# Altium project Main.PrjPCB (part 1 of 2)
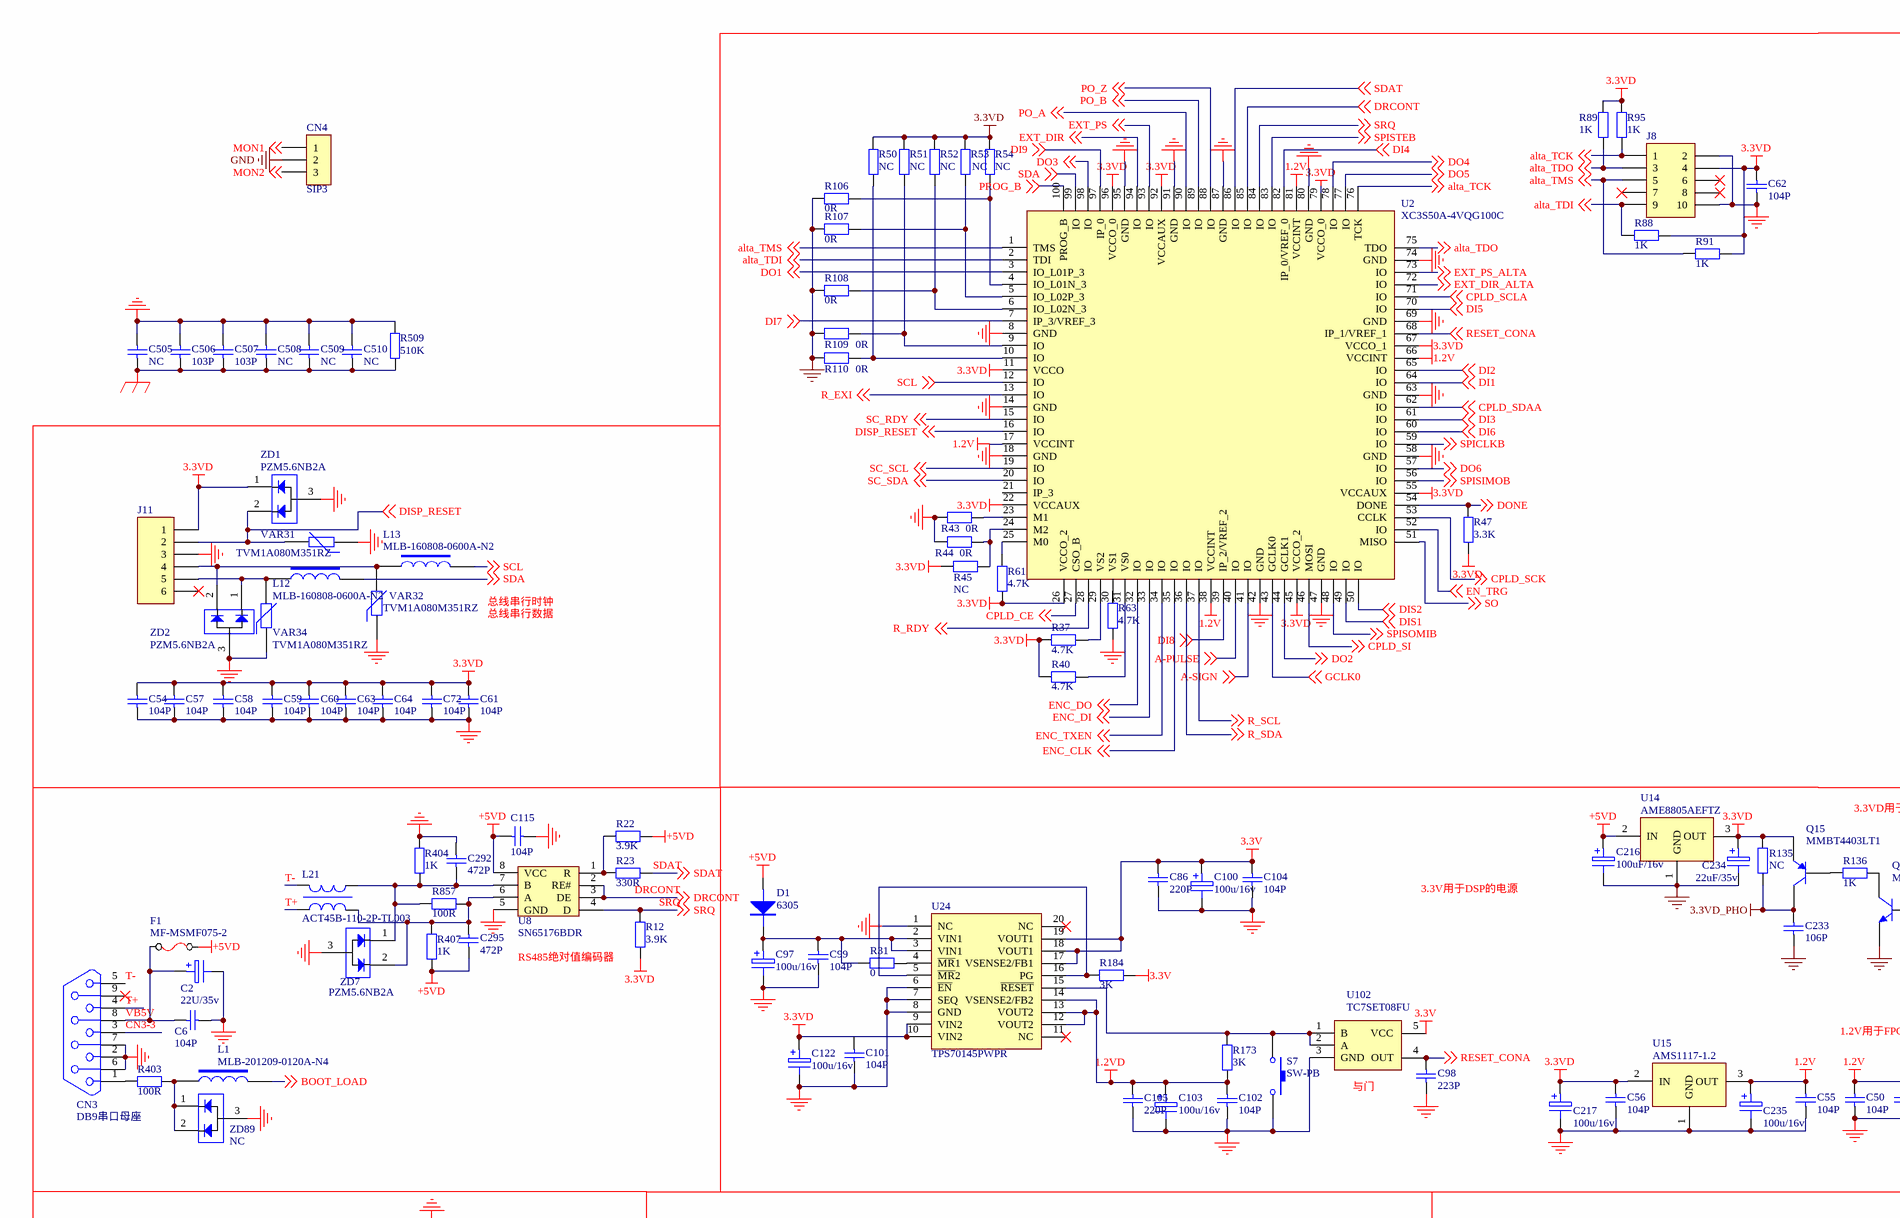
[diagram p0: Main-C.SchDoc, top left]
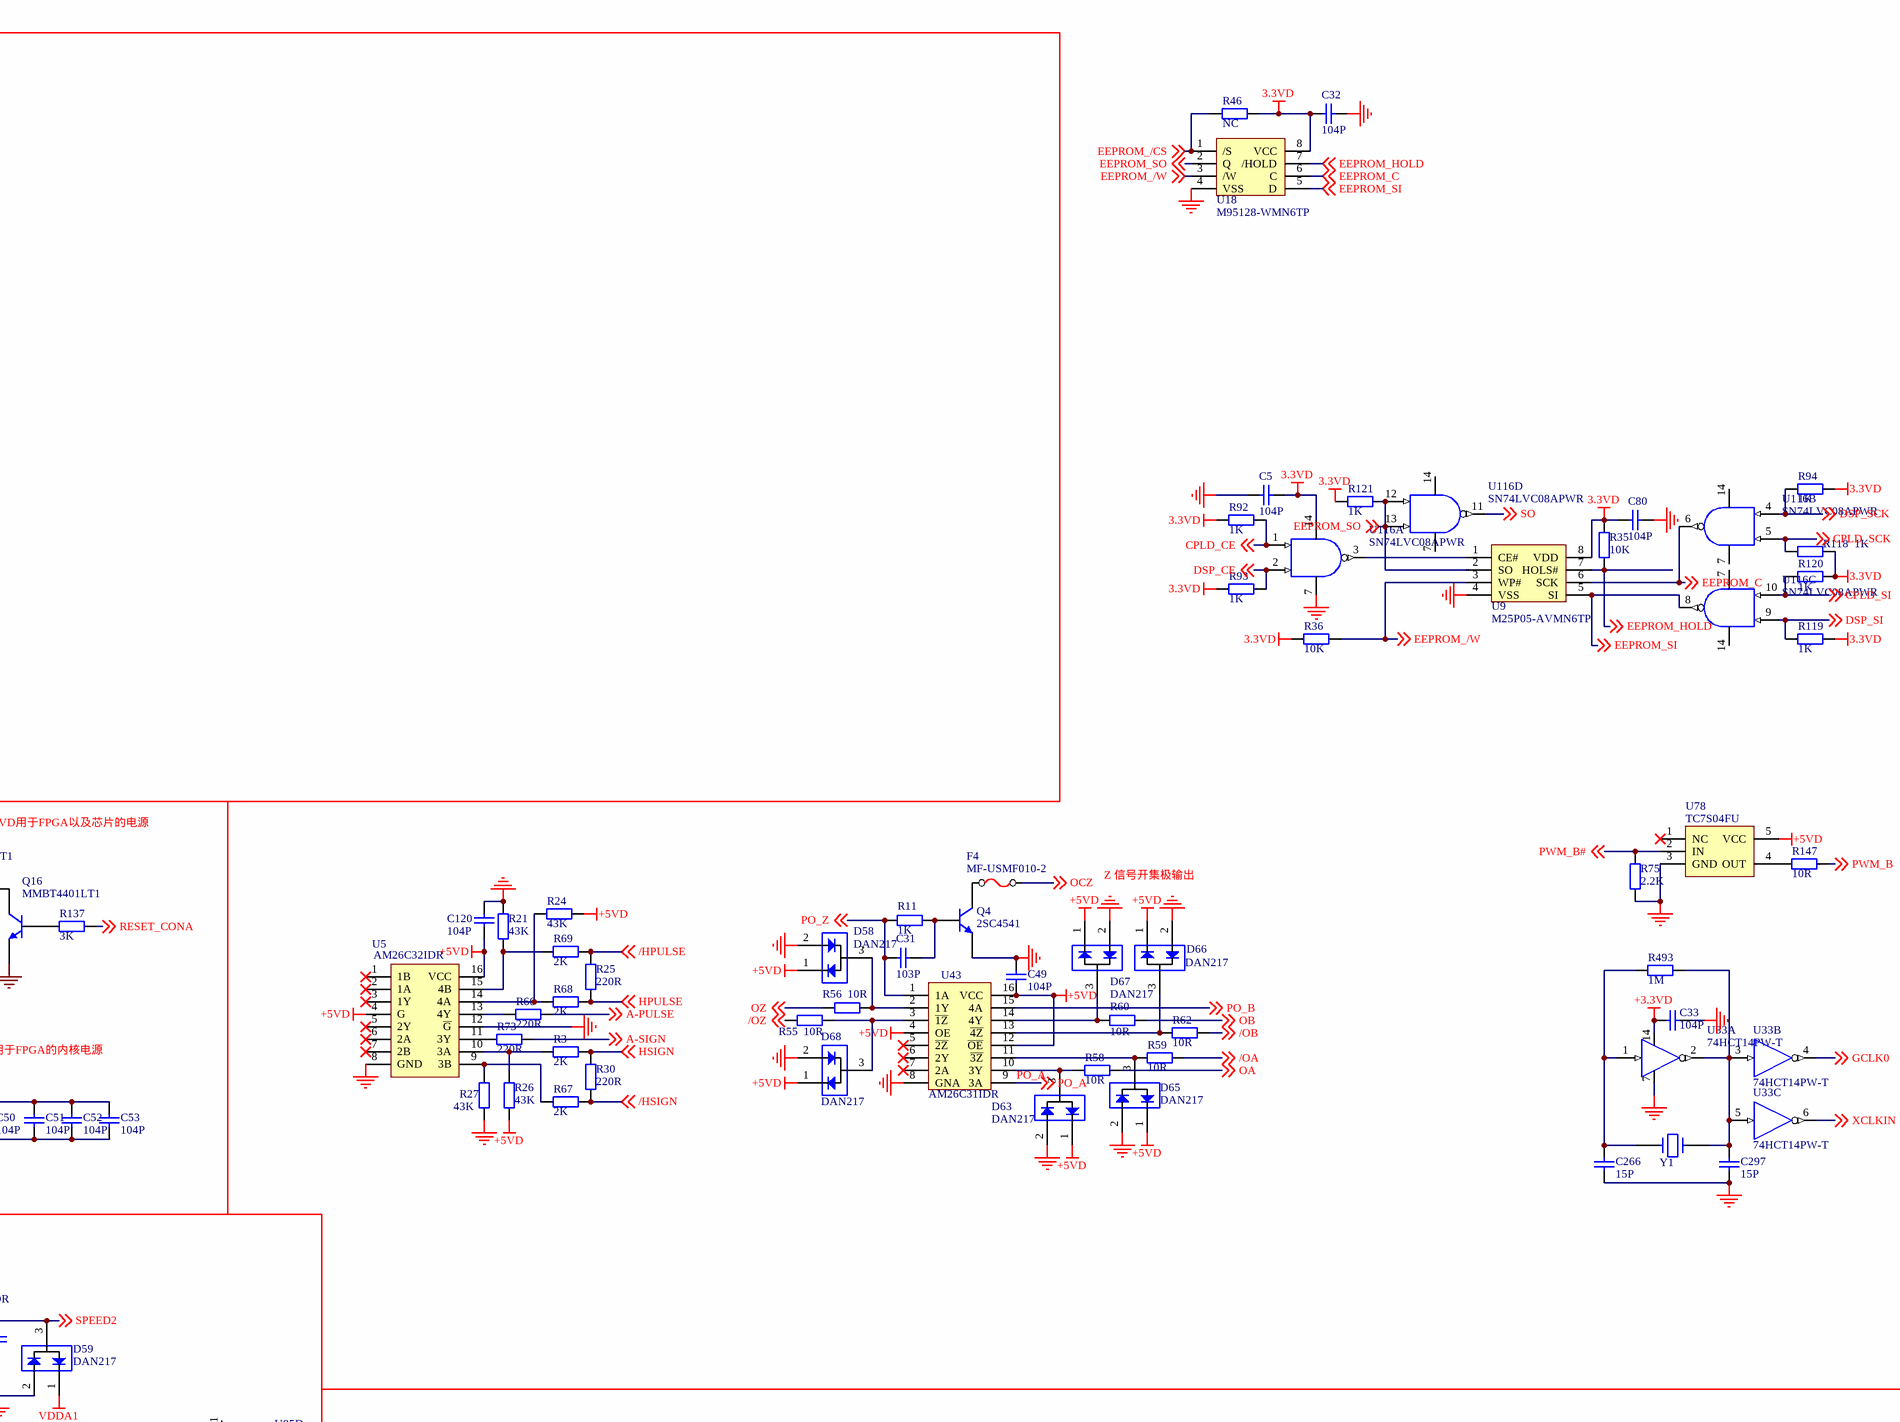
[diagram p1: Main-C.SchDoc, top middle]
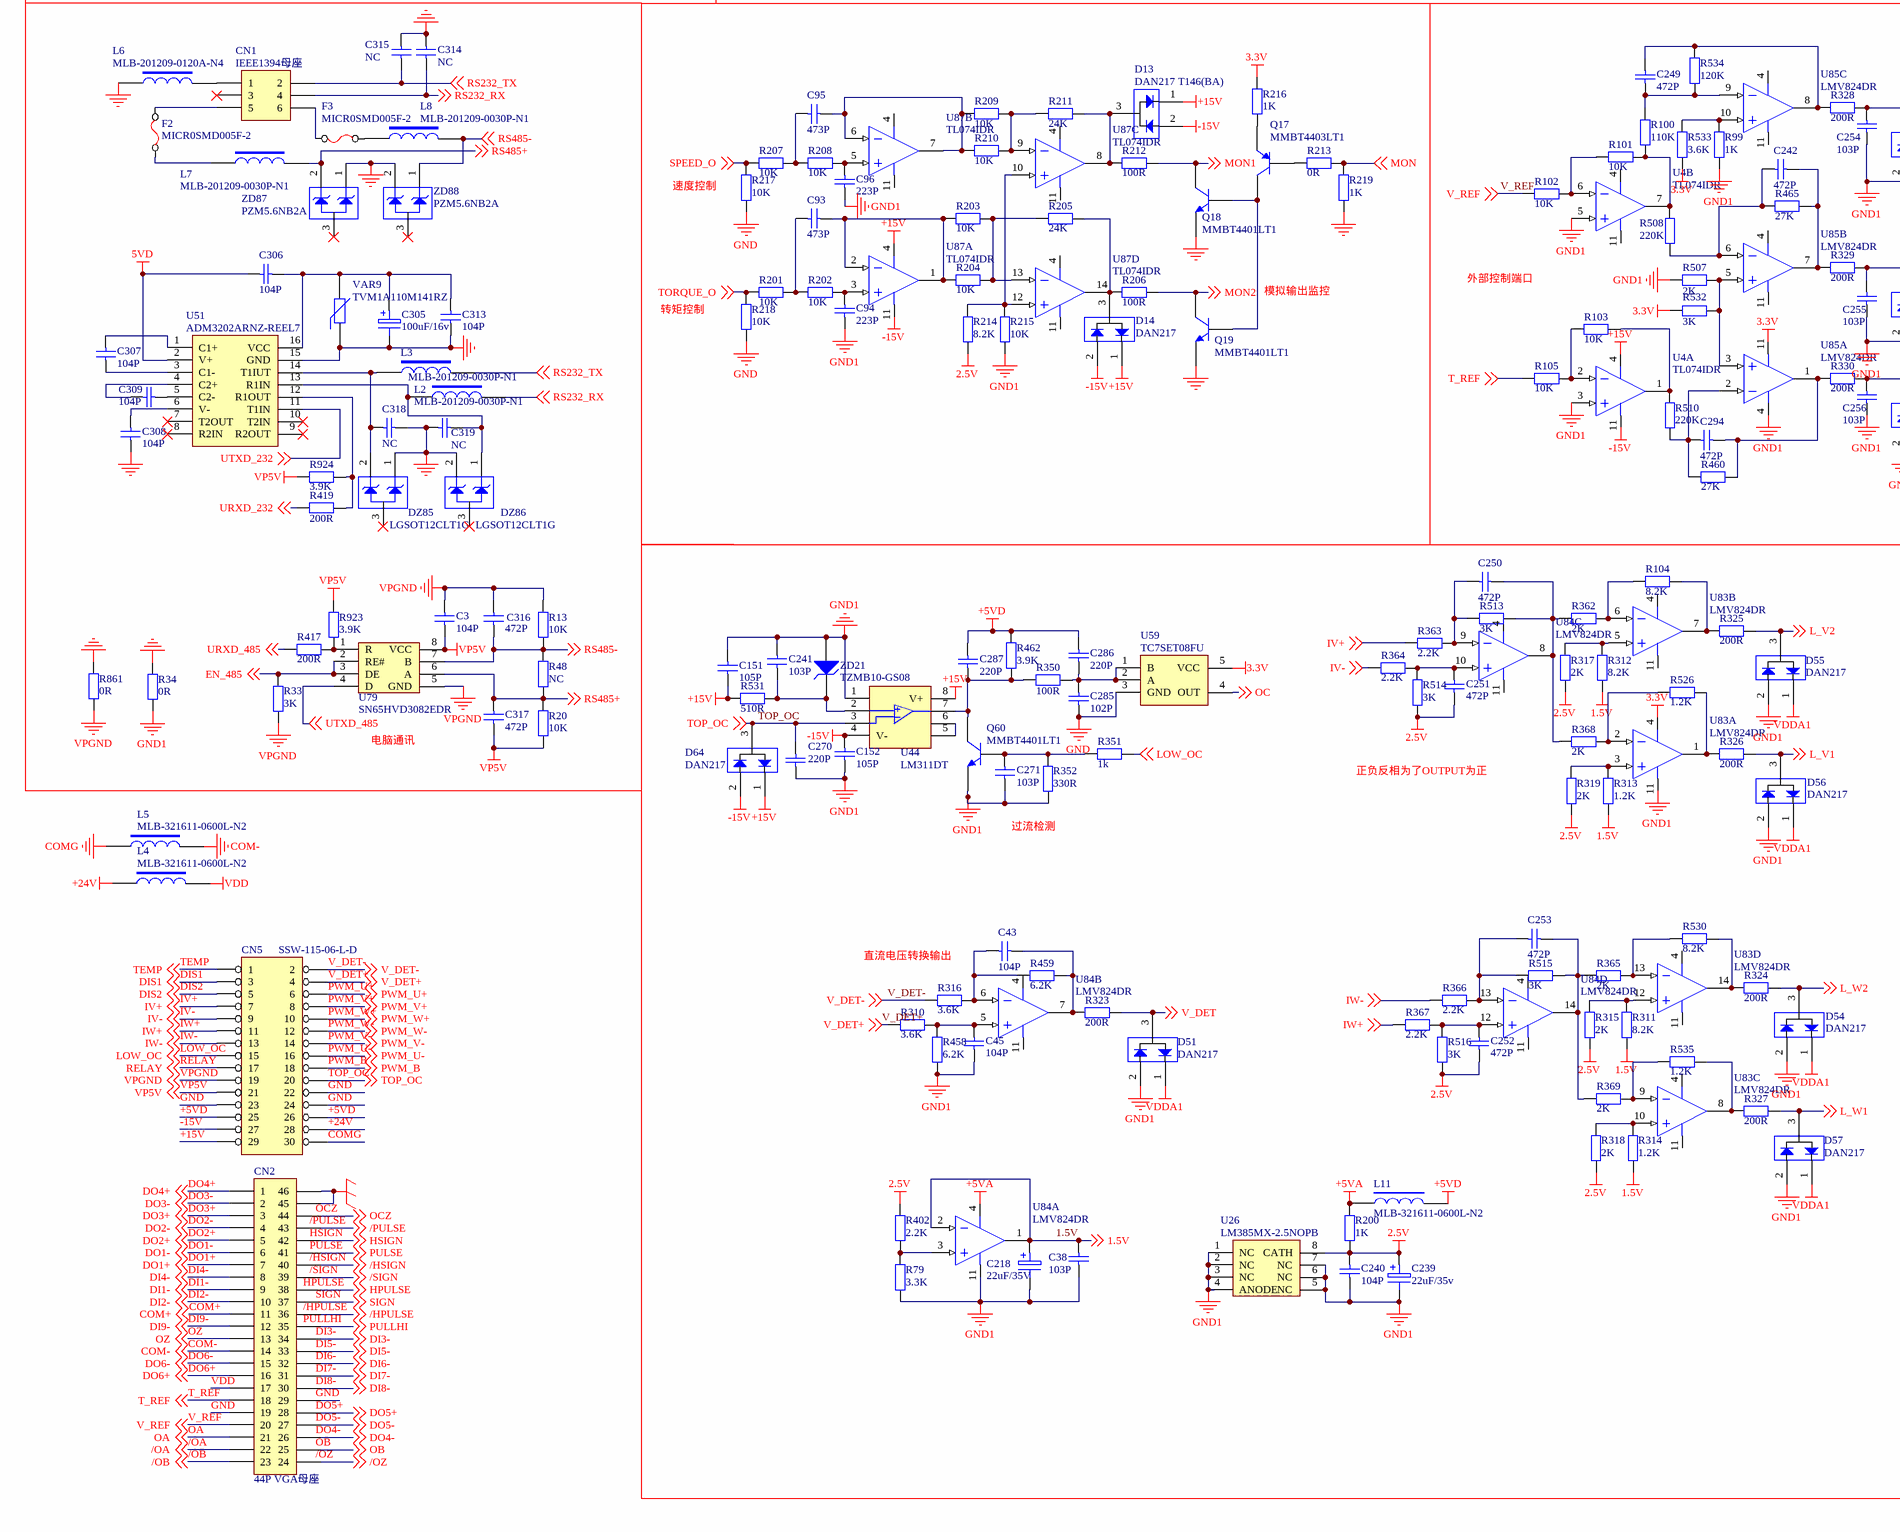
[diagram p2: Main-C.SchDoc, bottom left]
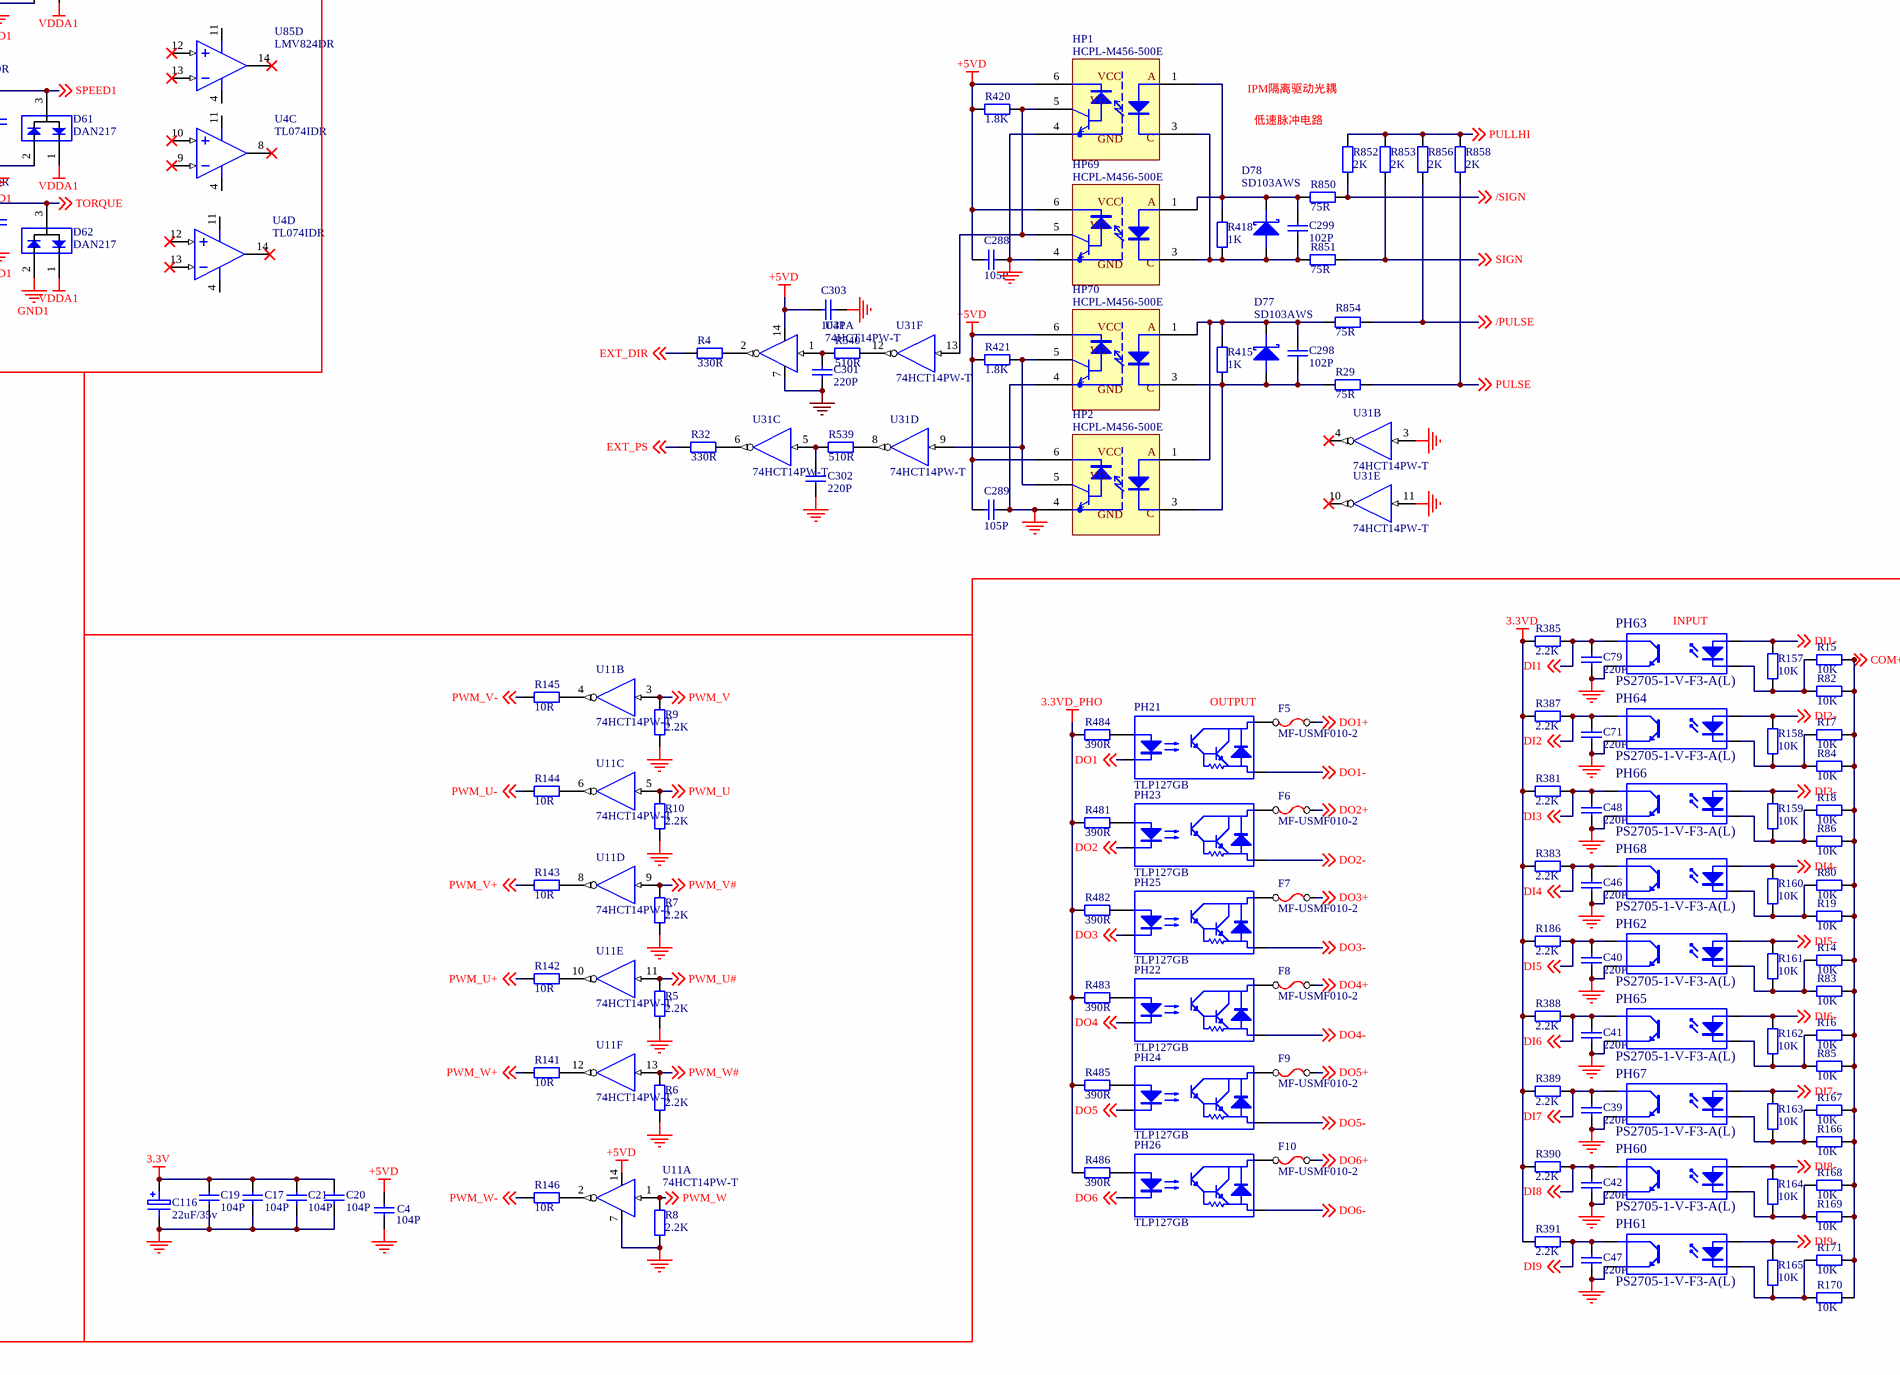
[diagram p3: Main-C.SchDoc, bottom middle]
6 sheets, 660 parts. Net scope: global (net labels, ports and power ports of the same name join across sheets).
Sheets:
  Main-C.SchDoc
  DSP-Core.SchDoc
  EnDat-Biss.SchDoc
  SinCos.SchDoc
  Resolver.SchDoc
  EtherCAT.SchDoc

## Sheet Main-C.SchDoc
size A1; PageSetup: Record=PageOptions|CenterHorizontal=True|CenterVertical=True|PrintScale=0.50|XCorrection=1.00|YCorrection=1.00|PrintKind=2|BorderSize=5000000|LeftOffset=0|BottomOffset=0|Orientation=2|PaperLength=4200|PaperWidth=2970|Scale=100|PaperSource=7|PrintQuality=600|MediaType=1|DitherType=10|PrintScaleMode=1|PaperKind=A3|PaperIndex=8

### Parts
C2  22U/35v  [EC46]
C3  104P  [0603C]
C4  104P  [0603C]
C5  104P  [0603C]
C6  104P  [0603C]
C17  104P  [0603C]
C19  104P  [0603C]
C20  104P  [0603C]
C21  104P  [0603C]
C31  103P  [0603C]
C32  104P  [0603C]
C33  104P  [0603C]
C38  103P  [0603C]
C39  220P  [0603C]
C40  220P  [0603C]
C41  220P  [0603C]
C42  220P  [0603C]
C43  104P  [0603C]
C45  104P  [0603C]
C46  220P  [0603C]
C47  220P  [0603C]
C48  220P  [0603C]
C49  104P  [0603C]
C50  104P  [0603C]
C51  104P  [0603C]
C52  104P  [0603C]
C53  104P  [0603C]
C54  104P  [0603C]
C55  104P  [0603C]
C56  104P  [0603C]
C57  104P  [0603C]
C58  104P  [0603C]
C59  104P  [0603C]
C60  104P  [0603C]
C61  104P  [0603C]
C62  104P  [0603C]
C63  104P  [0603C]
C64  104P  [0603C]
C71  220P  [0603C]
C72  104P  [0603C]
C79  220P  [0603C]
C80  104P  [0603C]
C86  220P  [0603C]
C93  473P  [0603C]
C94  223P  [0603C]
C95  473P  [0603C]
C96  223P  [0603C]
C97  100u/16v  [EC46]
C98  223P  [0603C]
C99  104P  [0603C]
C100  100u/16v  [EC46]
C101  104P  [0603C]
C102  104P  [0603C]
C103  100u/16v  [EC46]
C104  104P  [0603C]
C105  220P  [0603C]
C115  104P  [0603C]
C116  22uF/35v  [EC46]
C120  104P  [0603C]
C122  100u/16v  [EC46]
C151  105P  [0805C]
C152  105P  [0805C]
C216  100uF/16v  [EC46]
C217  100u/16v  [EC46]
C218  22uF/35V  [EC46]
C233  106P  [0805C]
C234  22uF/35v  [EC46]
C235  100u/16v  [EC46]
C239  22uF/35v  [EC46]
C240  104P  [0603C]
C241  103P  [0603C]
C242  472P  [0603C]
C249  472P  [0603C]
C250  472P  [0603C]
C251  472P  [0603C]
C252  472P  [0603C]
C253  472P  [0603C]
C254  103P  [0603C]
C255  103P  [0603C]
C256  103P  [0603C]
C266  15P  [0603C]
C270  220P  [0603C]
C271  103P  [0603C]
C285  102P  [0603C]
C286  220P  [0603C]
C287  220P  [0603C]
C288  105P  [0805C]
C289  105P  [0805C]
C292  472P  [0603C]
C294  472P  [0603C]
C295  472P  [0603C]
C297  15P  [0603C]
C298  102P  [0603C]
C299  102P  [0603C]
C301  220P  [0603C]
C302  220P  [0603C]
C303  104P  [0603C]
C305  100uF/16v  [EC46]
C306  104P  [0603C]
C307  104P  [0603C]
C308  104P  [0603C]
C309  104P  [0603C]
C313  104P  [0603C]
C314  NC  [0603C]
C315  NC  [0603C]
C316  472P  [0603C]
C317  472P  [0603C]
C318  NC  [0603C]
C319  NC  [0603C]
C505  NC  [2220]
C506  103P  [2220]
C507  103P  [2220]
C508  NC  [2220]
C509  NC  [2220]
C510  NC  [2220]
CN1  IEEE1394母座  [HDR2X3H]
CN2  44P VGA母座
CN3  value DB9串口母座  [DB9/F]  (hidden comment: Z2-DB9P/M)
CN4  SIP3  [SIP3-2.54]
CN5  SSW-115-06-L-D  [TB18]
D1  6305  [MLL35D]
D13  DAN217 T146(BA)  [SOT-23]
D14  DAN217  [SOT-23]
D51  DAN217  [SOT-23]
D54  DAN217  [SOT-23]
D55  DAN217  [SOT-23]
D56  DAN217  [SOT-23]
D57  DAN217  [SOT-23]
D58  DAN217  [SOT-23]
D59  DAN217  [SOT-23]
D61  DAN217  [SOT-23]
D62  DAN217  [SOT-23]
D63  DAN217  [SOT-23]
D64  DAN217  [SOT-23]
D65  DAN217  [SOT-23]
D66  DAN217  [SOT-23]
D67  DAN217  [SOT-23]
D68  DAN217  [SOT-23]
D77  SD103AWS
D78  SD103AWS
DZ85  LGSOT12CLT1G  [SOT-23]
DZ86  LGSOT12CLT1G  [SOT-23]
F1  MF-MSMF075-2
F2  MICR0SMD005F-2
F3  MICR0SMD005F-2
F4  MF-USMF010-2
F5  MF-USMF010-2
F6  MF-USMF010-2
F7  MF-USMF010-2
F8  MF-USMF010-2
F9  MF-USMF010-2
F10  MF-USMF010-2
HP1  HCPL-M456-500E  [SOP-5]
HP2  HCPL-M456-500E  [SOP-5]
HP69  HCPL-M456-500E  [SOP-5]
HP70  HCPL-M456-500E  [SOP-5]
J8  (no value)  [HDR2X5]
J11  Header 6  [HDR1X6]  (value not drawn)
L1  MLB-201209-0120A-N4  [1206R]
L2  MLB-201209-0030P-N1  [0805R]
L3  MLB-201209-0030P-N1  [0805R]
L4  MLB-321611-0600L-N2  [1206R]
L5  MLB-321611-0600L-N2  [1206R]
L6  MLB-201209-0120A-N4  [0805R]
L7  MLB-201209-0030P-N1  [0805R]
L8  MLB-201209-0030P-N1  [0805R]
L11  MLB-321611-0600L-N2  [1206R]
L12  MLB-160808-0600A-N2  [0805R]
L13  MLB-160808-0600A-N2  [0805R]
L21  ACT45B-110-2P-TL003  [INDUCTOR-M]
PH21  TLP127GB
PH22  TLP127GB
PH23  TLP127GB
PH24  TLP127GB
PH25  TLP127GB
PH26  TLP127GB
PH60  PS2705-1-V-F3-A(L)  [SOIC4]
PH61  PS2705-1-V-F3-A(L)  [SOIC4]
PH62  PS2705-1-V-F3-A(L)  [SOIC4]
PH63  PS2705-1-V-F3-A(L)  [SOIC4]
PH64  PS2705-1-V-F3-A(L)  [SOIC4]
PH65  PS2705-1-V-F3-A(L)  [SOIC4]
PH66  PS2705-1-V-F3-A(L)  [SOIC4]
PH67  PS2705-1-V-F3-A(L)  [SOIC4]
PH68  PS2705-1-V-F3-A(L)  [SOIC4]
Q4  2SC4541  [sot-89]
Q15  MMBT4403LT1  [SOT-23]
Q16  MMBT4401LT1  [SOT-23]
Q17  MMBT4403LT1  [SOT-23]
Q18  MMBT4401LT1  [SOT-23]
Q19  MMBT4401LT1  [SOT-23]
Q60  MMBT4401LT1  [SOT-23]
R3  2K  [0603R]
R4  330R  [0603R]
R5  2.2K  [0603R]
R6  2.2K  [0603R]
R7  2.2K  [0603R]
R8  2.2K  [0603R]
R9  2.2K  [0603R]
R10  2.2K  [0603R]
R11  1K  [0603R]
R12  3.9K  [0603R]
R13  10K  [0603R]
R14  10K  [1206R]
R15  10K  [1206R]
R16  10K  [1206R]
R17  10K  [1206R]
R18  10K  [1206R]
R19  10K  [1206R]
R20  10K  [0603R]
R21  43K  [0603R]
R22  3.9K  [0603R]
R23  330R  [0603R]
R24  43K  [0603R]
R25  220R  [1206R]
R26  43K  [0603R]
R27  43K  [0603R]
R29  75R  [0603R]
R30  220R  [1206R]
R31  0  [0603R]
R32  330R  [0603R]
R33  3K  [0603R]
R34  0R  [0603R]
R35  10K  [0603R]
R36  10K  [0603R]
R37  4.7K  [0603R]
R40  4.7K  [0603R]
R43  0R  [0603R]
R44  0R  [0603R]
R45  NC  [0603R]
R46  NC  [0603R]
R47  3.3K  [0603R]
R48  NC  [1206R]
R50  NC  [0603R]
R51  NC  [0603R]
R52  NC  [0603R]
R53  NC  [0603R]
R54  NC  [0603R]
R55  10R  [0603R]
R56  10R  [0603R]
R58  10R  [0603R]
R59  10R  [0603R]
R60  10R  [0603R]
R61  4.7K  [0603R]
R62  10R  [0603R]
R63  4.7K  [0603R]
R66  220R  [0603R]
R67  2K  [0603R]
R68  2K  [0603R]
R69  2K  [0603R]
R73  220R  [0603R]
R75  2.2K  [0603R]
R79  3.3K  [0603R]
R80  10K  [1206R]
R82  10K  [1206R]
R83  10K  [1206R]
R84  10K  [1206R]
R85  10K  [1206R]
R86  10K  [1206R]
R88  1K  [0603R]
R89  1K  [0603R]
R91  1K  [0603R]
R92  1K  [0603R]
R93  1K  [0603R]
R94  1K  [0603R]
R95  1K  [0603R]
R99  1K  [0603R]
R100  110K  [0603R]
R101  10K  [0603R]
R102  10K  [0603R]
R103  10K  [0603R]
R104  8.2K  [0603R]
R105  10K  [0603R]
R106  0R  [0603R]
R107  0R  [0603R]
R108  0R  [0603R]
R109  0R  [0603R]
R110  0R  [0603R]
R118  1K  [0603R]
R119  1K  [0603R]
R120  1K  [0603R]
R121  1K  [0603R]
R135  NC  [0603R]
R136  1K  [0603R]
R137  3K  [0603R]
R141  10R  [0603R]
R142  10R  [0603R]
R143  10R  [0603R]
R144  10R  [0603R]
R145  10R  [0603R]
R146  10R  [0603R]
R147  10R  [0603R]
R157  10K  [1206R]
R158  10K  [1206R]
R159  10K  [1206R]
R160  10K  [1206R]
R161  10K  [1206R]
R162  10K  [1206R]
R163  10K  [1206R]
R164  10K  [1206R]
R165  10K  [1206R]
R166  10K  [1206R]
R167  10K  [1206R]
R168  10K  [1206R]
R169  10K  [1206R]
R170  10K  [1206R]
R171  10K  [1206R]
R173  3K  [0603R]
R184  3K  [0603R]
R186  2.2K  [0603R]
R200  1K  [0603R]
R201  10K  [0603R]
R202  10K  [0603R]
R203  10K  [0603R]
R204  10K  [0603R]
R205  24K  [0603R]
R206  100R  [1206R]
R207  10K  [0603R]
R208  10K  [0603R]
R209  10K  [0603R]
R210  10K  [0603R]
R211  24K  [0603R]
R212  100R  [1206R]
R213  0R  [0603R]
R214  8.2K  [0603R]
R215  10K  [0603R]
R216  1K  [0603R]
R217  10K  [0603R]
R218  10K  [0603R]
R219  1K  [0603R]
R310  3.6K  [0603R]
R311  8.2K  [0603R]
R312  8.2K  [0603R]
R313  1.2K  [0603R]
R314  1.2K  [0603R]
R315  2K  [0603R]
R316  3.6K  [0603R]
R317  2K  [0603R]
R318  2K  [0603R]
R319  2K  [0603R]
R323  200R  [0603R]
R324  200R  [0603R]
R325  200R  [0603R]
R326  200R  [0603R]
R327  200R  [0603R]
R328  200R  [0603R]
R329  200R  [0603R]
R330  200R  [0603R]
R350  100R  [0603R]
R351  1k  [0603R]
R352  330R  [0603R]
R362  2K  [0603R]
R363  2.2K  [0603R]
R364  2.2K  [0603R]
R365  2K  [0603R]
R366  2.2K  [0603R]
R367  2.2K  [0603R]
R368  2K  [0603R]
R369  2K  [0603R]
R381  2.2K  [0603R]
R383  2.2K  [0603R]
R385  2.2K  [0603R]
R387  2.2K  [0603R]
R388  2.2K  [0603R]
R389  2.2K  [0603R]
R390  2.2K  [0603R]
R391  2.2K  [0603R]
R402  2.2K  [0603R]
R403  100R  [0603R]
R404  1K  [0603R]
R407  1K  [0603R]
R415  1K  [0603R]
R417  200R  [0603R]
R418  1K  [0603R]
R419  200R  [0603R]
R420  1.8K  [0603R]
R421  1.8K  [0603R]
R458  6.2K  [0603R]
R459  6.2K  [0603R]
R460  27K  [0603R]
R462  3.9K  [0603R]
R465  27K  [0603R]
R481  390R  [0603R]
R482  390R  [0603R]
R483  390R  [0603R]
R484  390R  [0603R]
R485  390R  [0603R]
R486  390R  [0603R]
R493  1M  [0603R]
R507  2K  [0603R]
R508  220K  [0603R]
R509  510K  [2512]
R510  220K  [0603R]
R513  3K  [0603R]
R514  3K  [0603R]
R515  3K  [0603R]
R516  3K  [0603R]
R526  1.2K  [0603R]
R530  8.2K  [0603R]
R531  510R  [0603R]
R532  3K  [0603R]
R533  3.6K  [0603R]
R534  120K  [0603R]
R535  1.2K  [0603R]
R539  510R  [0603R]
R540  510R  [0603R]
R850  75R  [0603R]
R851  75R  [0603R]
R852  2K  [0603R]
R853  2K  [0603R]
R854  75R  [0603R]
R856  2K  [0603R]
R857  100R  [0603R]
R858  2K  [0603R]
R861  0R  [0603R]
R923  3.9K  [0603R]
R924  3.9K  [0603R]
S7  SW-PB  [SPST-2]
U2  XC3S50A-4VQG100C  [VFQ100]
U4  TL074IDR  [SOP-14]  (parts A,B,C,D of 4)
U5  AM26C32IDR  [SO-16]
U8  SN65176BDR  [SOP-8]
U9  M25P05-AVMN6TP  [SOP-8]
U11  74HCT14PW-T  [sop-14]  (parts A,B,C,D,E,F of 6)
U14  AME8805AEFTZ  [SOT-89]
U15  AMS1117-1.2  [SOT-223]
U18  M95128-WMN6TP  [SOP-8]
U24  TPS70145PWPR  [SSOP-20-1]
U26  LM385MX-2.5NOPB  [SOP-8]
U31  74HCT14PW-T  [sop-14]  (parts A,B,C,D,E,F of 6)
U33  74HCT14PW-T  [sop-14]  (parts A,B,C of 6)
U43  AM26C31IDR  [SO-16]
U44  LM311DT  [SOP-8]
U51  ADM3202ARNZ-REEL7  [SO-16]
U59  TC7SET08FU  [SSOP5-P-0.65A]
U78  TC7S04FU  [SSOP5-P-0.65A]
U79  SN65HVD3082EDR  [SOP-8]
U83  LMV824DR  [SOP-14]  (parts A,B,C,D of 4)
U84  LMV824DR  [SOP-14]  (parts A,B,C,D of 4)
U85  LMV824DR  [SOP-14]  (parts A,B,C,D of 4)
U87  TL074IDR  [SOP-14]  (parts A,B,C,D of 4)
U102  TC7SET08FU  [SSOP5-P-0.65A]
U116  SN74LVC08APWR  [751A-02_N]  (parts A,B,C,D of 4)
VAR9  TVM1A110M141RZ  [0603R]
VAR31  TVM1A080M351RZ  [0603R]
VAR32  TVM1A080M351RZ  [0603R]
VAR34  TVM1A080M351RZ  [0603R]
Y1  CRY  [CY4X7]  (value not drawn)
ZD1  PZM5.6NB2A  [SOT-23]
ZD2  PZM5.6NB2A  [SOT-23]
ZD7  PZM5.6NB2A  [SOT-23]
ZD21  TZMB10-GS08  [MLL34D]
ZD87  PZM5.6NB2A  [SOT-23]
ZD88  PZM5.6NB2A  [SOT-23]
ZD89  NC  [SOT-23]

### Nets
1.2V: C50.2 C51.1 C52.1 C53.1 C55.2 C235.1 U2.17(VCCINT) U2.38(VCCINT) U2.66(VCCINT) U2.81(VCCINT) U15.3(OUT)
1.2VD: C102.2 C103.1 C105.2 R173.2 U24.12(VOUT2) U24.13(VOUT2) U24.14(VSENSE2/FB2)
1.5V: C38.2 C218.1 R311.1 R312.1 R313.1 R314.1 U84.1(OUT) U84.2(IN-) ; off-sheet 1.5V
2.5V: C239.1 C240.1 C251.1 C252.1 R200.1 R214.2 R315.1 R317.1 R318.1 R319.1 R402.2 R514.1 R516.1 U26.8(CATH)
3.3V: C17.2 C19.1 C20.1 C21.2 C86.2 C100.1 C104.2 C116.1 R184.2 R216.2 R532.2 R533.1 U24.17(VSENSE2/FB1) U24.18(VOUT1) U24.19(VOUT1) U59.5(VCC) U83.4(GND) U85.11(V+) U102.5(VCC)
3.3VD: C5.1 C32.1 C54.1 C56.2 C57.2 C58.2 C59.2 C60.1 C61.1 C62.1 C63.1 C64.2 C72.2 C80.2 C101.2 C122.1 C217.1 C234.1 J8.4 J11.1 Q15.1(E) R12.1 R35.1 R36.1 R37.2 R40.2 R45.1 R46.1 R47.2 R50.1 R51.1 R52.1 R53.1 R54.2 R61.2 R88.1 R89.1 R91.1 R92.1 R93.1 R94.1 R95.1 R118.2 R119.2 R120.2 R121.1 R135.2 R186.1 R381.2 R383.2 R385.2 R387.2 R388.2 R389.2 R390.2 R391.1 U2.11(VCCO) U2.22(VCCAUX) U2.26(VCCO_2) U2.45(VCCO_2) U2.55(VCCAUX) U2.67(VCCO_1) U2.79(VCCO_0) U2.92(VCCAUX) U2.96(VCCO_0) U9.8(VDD) U14.3(OUT) U15.2(IN) U18.8(VCC) U24.9(VIN2) U24.10(VIN2) U116.14(VCC) ZD1.1
3.3VD_PHO: C233.2 Q15.3(C) R135.1 R481.1 R482.1 R483.1 R484.2 R485.1 R486.1
5VD: C306.2 U51.2(V+)
+3.3VD: C33.2 U33.14(VCC)
+5VA: L11.1 R200.2 U84.4(GND)
+5VD: C4.1 C49.2 C115.1 C120.1 C216.1 C286.2 C287.2 C288.2 C289.1 C295.2 C303.2 CN5.25 CN5.26 D1.1 D58.1 D63.1 D65.1 D66.1 D67.1 D68.1 F1.2 HP1.6 HP2.6 HP69.6 HP70.6 L11.2 R22.2 R24.1 R26.1 R407.1 R420.2 R421.2 R462.2 U5.4(G) U5.16(VCC) U8.8(VCC) U11.14(VCC) U14.2(IN) U31.14(VCC) U43.4(OE) U43.12(~{OE}) U43.16(VCC) U78.5(VCC)
+15V: C151.2 CN5.29 D13.1 D14.1 D64.1 R531.2 U4.4(GND) U44.8(V+) U87.4(GND)
+24V: CN5.28 L4.2
-15V: C152.2 CN5.27 D13.2 D14.2 D64.2 U4.11(V+) U44.4(V-) U87.11(V+)
COM-: CN2.14 L5.1 ; off-sheet COM-
COMG: CN5.30 L5.2
EARTH: C505.2 C506.2 C507.2 C508.2 C509.2 C510.2 CN2.45 CN2.46 R509.1
GND: C2.2 C4.2 C5.2 C6.2 C17.1 C19.2 C20.2 C21.1 C32.2 C33.1 C39.1 C40.1 C41.1 C42.1 C46.1 C47.1 C48.1 C49.1 C50.1 C51.2 C52.2 C53.2 C54.2 C55.1 C56.1 C57.1 C58.1 C59.1 C60.2 C61.2 C62.2 C63.2 C64.1 C71.1 C72.1 C79.1 C80.1 C86.1 C97.2 C98.1 C99.1 C100.2 C101.1 C102.1 C103.2 C104.1 C105.1 C115.2 C116.2 C120.2 C122.2 C216.2 C217.2 C233.1 C234.2 C235.2 C266.1 C285.1 C288.1 C289.2 C292.1 C297.1 C301.1 C302.2 C303.1 C305.2 C308.1 C313.2 C314.2 C315.1 C318.2 C319.1 C505.1 C506.1 C507.1 C508.1 C509.1 C510.1 CN2.19 CN3.2 CN3.6 CN3.7 CN4.2 CN5.22 CN5.23 CN5.24 D58.2 D63.2 D65.2 D66.2 D67.2 D68.2 DZ85.1 DZ86.2 HP1.4 HP2.4 HP69.4 HP70.4 J8.2 J8.10 J11.3 L6.2 PH60.3 PH61.3 PH62.3 PH63.3 PH64.3 PH65.3 PH66.3 PH67.3 PH68.3 Q4.1(E) Q16.1(E) Q18.1(E) Q19.1(E) R5.1 R6.1 R7.1 R8.1 R9.1 R10.1 R21.2 R27.1 R34.2 R43.1 R44.1 R63.1 R75.2 R106.1 R107.2 R108.2 R109.2 R110.2 R217.1 R218.1 R219.1 R404.2 R509.2 R861.2 S7.2 U2.8(GND) U2.14(GND) U2.18(GND) U2.42(GND) U2.47(GND) U2.58(GND) U2.63(GND) U2.69(GND) U2.74(GND) U2.80(GND) U2.87(GND) U2.91(GND) U2.95(GND) U5.8(GND) U5.12(~{G}) U8.5(GND) U9.4(VSS) U11.7(GND) U14.1(GND) U15.1(GND) U18.4(VSS) U24.1(NC) U24.6(~{EN}) U24.7(SEQ) U24.8(GND) U31.3(IN) U31.7(GND) U31.11(IN) U33.7(GND) U43.8(GNA) U51.15(GND) U59.3(GND) U78.3(GND) U102.3(GND) U116.7(GND) VAR9.1 VAR31.1 VAR32.1 VAR34.1 ZD1.3 ZD2.3 ZD7.3 ZD87.1 ZD88.2 ZD89.3
GND1: C38.1 C45.1 C94.1 C96.2 C151.1 C152.1 C218.2 C239.2 C240.2 C241.1 C254.1 C255.2 C256.2 C270.2 C271.1 D51.2 D54.2 D55.2 D56.2 D57.2 D59.2 D61.2 D62.2 Q60.1(E) R34.1 R79.1 R99.1 R215.2 R352.1 R458.1 R507.2 U4.3(IN+) U4.5(IN+) U26.1(NC) U26.2(NC) U26.3(NC) U26.4(ANODE) U26.5(NC) U26.6(NC) U26.7(NC) U44.1(GROUNT) U83.11(V+) U84.11(V+) U85.4(GND) ZD21.1(A)
VDD: CN2.17 L4.1
VDDA1: D51.1 D54.1 D55.1 D56.1 D57.1 D59.1 D61.1 D62.1
VP5V: C3.2 C317.2 CN5.21 R20.2 R923.1 R924.2 U79.8(VCC) ; off-sheet VP5V
VPGND: C3.1 C316.1 CN5.19 R13.1 R33.2 R861.1 U79.5(GND) ; off-sheet VPGND
/HPULSE: CN2.36 R25.2 R69.2 ; off-sheet /HPULSE
/HSIGN: CN2.40 R30.1 R67.2 ; off-sheet /HSIGN
/OA: CN2.22 R59.2 ; off-sheet /OA
/OB: CN2.23 R62.2 ; off-sheet /OB
/OZ: CN2.24 R55.1 ; off-sheet /OZ
/PULSE: CN2.43 R854.1 R856.1 ; off-sheet /PULSE
/SIGN: CN2.39 R850.1 R852.1 ; off-sheet /SIGN
A-PULSE: R66.2 U2.40(IO) ; off-sheet A-PULSE
A-SIGN: R73.2 U2.41(IO) ; off-sheet A-SIGN
alta_TCK: J8.1 R95.2 U2.76(TCK) ; off-sheet alta_TCK
alta_TDI: J8.9 R88.2 U2.2(TDI) ; off-sheet alta_TDI
alta_TDO: J8.3 R89.2 U2.75(TDO) ; off-sheet alta_TDO
alta_TMS: J8.5 R91.2 U2.1(TMS) ; off-sheet alta_TMS
BOOT_LOAD: L1.1 ; off-sheet BOOT_LOAD
CN3-3: CN3.3
COM+: CN2.11 R14.2 R15.2 R16.1 R17.1 R18.1 R19.1 R80.1 R82.2 R83.2 R84.2 R85.1 R86.1 R166.1 R167.1 R168.2 R169.2 R170.2 R171.2 ; off-sheet COM+
CPLD_CE: R92.2 U2.27(CSO_B) U116.1(A) ; off-sheet CPLD_CE
CPLD_SCK: R118.1 U2.53(CCLK) U116.5(B) ; off-sheet CPLD_SCK
CPLD_SCLA: U2.71(IO) ; off-sheet CPLD_SCLA
CPLD_SDAA: U2.62(IO) ; off-sheet CPLD_SDAA
CPLD_SI: R120.1 U2.46(MOSI) U116.10(B) ; off-sheet CPLD_SI
DI1: C79.2 PH63.4 R385.1 U2.64(IO) ; off-sheet DI1
DI1-: CN2.9 PH63.1 R157.1 ; off-sheet DI1-
DI2: C71.2 PH64.4 R387.1 U2.65(IO) ; off-sheet DI2
DI2-: CN2.10 PH64.1 R158.1 ; off-sheet DI2-
DI3: C48.2 PH66.4 R381.1 U2.61(IO) ; off-sheet DI3
DI3-: CN2.34 PH66.1 R159.1 ; off-sheet DI3-
DI4: C46.2 PH68.4 R383.1 U2.82(IP_0/VREF_0) ; off-sheet DI4
DI4-: CN2.8 PH68.1 R160.2 ; off-sheet DI4-
DI5: C40.2 PH62.4 R186.2 U2.70(IO) ; off-sheet DI5
DI5-: CN2.33 PH62.1 R161.1 ; off-sheet DI5-
DI6: C41.2 PH65.4 R388.1 U2.60(IO) ; off-sheet DI6
DI6-: CN2.32 PH65.1 R162.2 ; off-sheet DI6-
DI7: C39.2 PH67.4 R389.1 U2.7(IP_3/VREF_3) ; off-sheet DI7
DI7-: CN2.31 PH67.1 R163.1 ; off-sheet DI7-
DI8: C42.2 PH60.4 R390.1 U2.39(IP_2/VREF_2) ; off-sheet DI8
DI8-: CN2.30 PH60.1 R164.1 ; off-sheet DI8-
DI9: C47.2 PH61.4 R391.2 U2.97(IP_0) ; off-sheet DI9
DI9-: CN2.12 PH61.1 R165.2 ; off-sheet DI9-
DIS1: CN5.3 U2.49(IO) ; off-sheet DIS1
DIS2: CN5.5 U2.50(IO) ; off-sheet DIS2
DISP_RESET: J11.2 U2.16(IO) VAR31.2 ZD1.2 ; off-sheet DISP_RESET
DO1: PH21.2(LED_Cathode) U2.3(IO_L01P_3) ; off-sheet DO1
DO1+: CN2.7 F5.2 ; off-sheet DO1+
DO1-: CN2.6 PH21.3 ; off-sheet DO1-
DO2: PH23.2(LED_Cathode) U2.44(GCLK1) ; off-sheet DO2
DO2+: CN2.5 F6.2 ; off-sheet DO2+
DO2-: CN2.4 PH23.3 ; off-sheet DO2-
DO3: PH25.2(LED_Cathode) U2.98(IO) ; off-sheet DO3
DO3+: CN2.3 F7.2 ; off-sheet DO3+
DO3-: CN2.2 PH25.3 ; off-sheet DO3-
DO4: PH22.2(LED_Cathode) U2.78(IO) ; off-sheet DO4
DO4+: CN2.1 F8.2 ; off-sheet DO4+
DO4-: CN2.26 PH22.3 ; off-sheet DO4-
DO5: PH24.2(LED_Cathode) U2.77(IO) ; off-sheet DO5
DO5+: CN2.28 F9.2 ; off-sheet DO5+
DO5-: CN2.27 PH24.3 ; off-sheet DO5-
DO6: PH26.2(LED_Cathode) U2.57(IO) ; off-sheet DO6
DO6+: CN2.16 F10.2 ; off-sheet DO6+
DO6-: CN2.15 PH26.3 ; off-sheet DO6-
DONE: R47.1 U2.54(DONE) ; off-sheet DONE
DRCONT: U2.85(IO) U8.2(RE#) U8.3(DE) ; off-sheet DRCONT
DSP_CE: R93.2 U116.2(B) ; off-sheet DSP_CE
DSP_SCK: R94.2 U116.4(A) ; off-sheet DSP_SCK
DSP_SI: R119.1 U116.9(A) ; off-sheet DSP_SI
EEPROM_/CS: R46.2 U18.1(/S) ; off-sheet EEPROM_/CS
EEPROM_/W: R36.2 U9.3(WP#) U18.3(/W) ; off-sheet EEPROM_/W
EEPROM_C: U9.6(SCK) U18.6(C) U116.6(Y) ; off-sheet EEPROM_C
EEPROM_HOLD: R35.2 U9.7(HOLS#) U18.7(/HOLD) ; off-sheet EEPROM_HOLD
EEPROM_SI: U9.5(SI) U18.5(D) U116.8(Y) ; off-sheet EEPROM_SI
EEPROM_SO: R121.2 U9.2(SO) U18.2(Q) U116.12(A) U116.13(B) ; off-sheet EEPROM_SO
EN_485: R33.1 U79.2(RE#) U79.3(DE) ; off-sheet EN_485
EN_TRG: U2.52(IO) ; off-sheet EN_TRG
ENC_CLK: U2.35(IO) ; off-sheet ENC_CLK
ENC_DI: U2.32(IO) U2.33(IO) ; off-sheet ENC_DO, off-sheet ENC_DI  [also labelled ENC_DO]
ENC_TXEN: U2.34(IO) ; off-sheet ENC_TXEN
EXT_DIR: R4.1 U2.94(IO) ; off-sheet EXT_DIR
EXT_DIR_ALTA: U2.72(IO) ; off-sheet EXT_DIR_ALTA
EXT_PS: R32.1 U2.93(IO) ; off-sheet EXT_PS
EXT_PS_ALTA: U2.73(IO) ; off-sheet EXT_PS_ALTA
GCLK0: U2.43(GCLK0) U33.4(~{OUT}) ; off-sheet GCLK0
HPULSE: CN2.38 R25.1 R68.2 ; off-sheet HPULSE
HSIGN: CN2.42 R3.2 R30.2 ; off-sheet HSIGN
IV+: CN5.7 R363.1 ; off-sheet IV+
IV-: CN5.9 R364.1 ; off-sheet IV-
IW+: CN5.11 R367.1 ; off-sheet IW+
IW-: CN5.13 R366.1 ; off-sheet IW-
L_V1: D56.3 R326.2 ; off-sheet L_V1
L_V2: D55.3 R325.2 ; off-sheet L_V2
L_W1: D57.3 R327.2 ; off-sheet L_W1
L_W2: D54.3 R324.2 ; off-sheet L_W2
LOW_OC: CN5.15 R351.1 ; off-sheet LOW_OC
MON: R213.2 R219.2 ; off-sheet MON
MON1: CN4.1 Q18.3(C) R212.2 ; off-sheet MON1
MON2: CN4.3 Q19.3(C) R206.1 ; off-sheet MON2
OA: CN2.21 R58.2 ; off-sheet OA
OB: CN2.25 R60.2 ; off-sheet OB
OC: U59.4(OUT) ; off-sheet OC
OCZ: CN2.44 F4.2 ; off-sheet OCZ
OZ: CN2.13 R56.1 ; off-sheet OZ
PO_A: U2.90(IO) U43.9(3A) ; off-sheet PO_A
PO_B: U2.89(IO) U43.15(4A) ; off-sheet PO_B
PO_Z: C31.1 R11.1 U2.88(IO) U43.1(1A) ; off-sheet PO_Z
PROG_B: U2.100(PROG_B) ; off-sheet PROG_B
PULLHI: CN2.35 R852.2 R853.2 R856.2 R858.2 ; off-sheet PULLHI
PULSE: CN2.41 R29.1 R858.1 ; off-sheet PULSE
PWM_B: CN5.18 R147.2 ; off-sheet PWM_B
PWM_B#: R75.1 U78.2(IN) ; off-sheet PWM_B#
PWM_U: R10.2 U11.5(IN) ; off-sheet PWM_U
PWM_U#: R5.2 U11.11(IN) ; off-sheet PWM_U#
PWM_U+: CN5.6 R142.2 ; off-sheet PWM_U+
PWM_U-: CN5.16 R144.2 ; off-sheet PWM_U-
PWM_V: R9.2 U11.3(IN) ; off-sheet PWM_V
PWM_V#: R7.2 U11.9(IN) ; off-sheet PWM_V#
PWM_V+: CN5.8 R143.2 ; off-sheet PWM_V+
PWM_V-: CN5.14 R145.2 ; off-sheet PWM_V-
PWM_W: R8.2 U11.1(IN) ; off-sheet PWM_W
PWM_W#: R6.2 U11.13(IN) ; off-sheet PWM_W#
PWM_W+: CN5.10 R141.2 ; off-sheet PWM_W+
PWM_W-: CN5.12 R146.2 ; off-sheet PWM_W-
R_EXI: U2.13(IO) ; off-sheet R_EXI
R_RDY: U2.28(IO) ; off-sheet R_RDY
RELAY: CN5.17 ; off-sheet RELAY
RESET_CONA: C98.2 R137.2 U2.68(IP_1/VREF_1) U102.4(OUT) ; off-sheet RESET_CONA
RS232_RX: C314.1 CN1.4 L2.1 ; off-sheet RS232_RX
RS232_TX: C315.2 CN1.2 L3.1 ; off-sheet RS232_TX
RS485+: C317.1 L7.1 R20.1 R48.2 U79.6(A) ZD87.2 ; off-sheet RS485+
RS485-: C316.2 L8.1 R13.2 R48.1 U79.7(B) ZD88.1 ; off-sheet RS485-
SC_RDY: U2.15(IO) ; off-sheet SC_RDY
SC_SCL: U2.19(IO) U2.37(IO) ; off-sheet SC_SCL, off-sheet R_SCL  [also labelled R_SCL]
SC_SDA: U2.20(IO) U2.36(IO) ; off-sheet SC_SDA, off-sheet R_SDA  [also labelled R_SDA]
SCL: L13.1 U2.12(IO) ; off-sheet SCL
SDA: L12.1 U2.99(IO) ; off-sheet SDA
SDAT: R23.1 U2.86(IO) ; off-sheet SDAT
SIGN: CN2.37 R851.1 R853.1 ; off-sheet SIGN
SO: U2.51(MISO) U116.11(Y) ; off-sheet SO
SPEED1: C255.1 D61.3 R329.1 ; off-sheet SPEED1
SPEED2: C254.2 D59.3 R328.1 ; off-sheet SPEED2
SPEED_O: R207.1 R217.2 ; off-sheet SPEED_O
SPICLKB: U2.59(IO) ; off-sheet SPICLKB
SPISIMOB: U2.56(IO) ; off-sheet SPISIMOB
SPISOMIB: U2.48(IO) ; off-sheet SPISOMIB
SPISTEB: U2.83(IO) ; off-sheet SPISTEB
SRQ: R12.2 U2.84(IO) U8.4(D) ; off-sheet SRQ
T+: CN3.4 L21.1
T-: CN3.5 L21.2
T_REF: CN2.18 R105.1 ; off-sheet T_REF
TEMP: CN5.1 ; off-sheet TEMP
TOP_OC: C270.1 CN5.20 D64.3 U44.3(INPUT) ; off-sheet TOP_OC
TORQUE: C256.1 D62.3 R330.1 ; off-sheet TORQUE
TORQUE_O: R201.1 R218.2 ; off-sheet TORQUE_O
URXD_232: R419.2 ; off-sheet URXD_232
URXD_485: R417.1 ; off-sheet URXD_485
UTXD_232: U51.11(T1IN) ; off-sheet UTXD_232
UTXD_485: U79.4(D) ; off-sheet UTXD_485
V_DET: D51.3 R323.2 ; off-sheet V_DET
V_DET+: CN5.4 R310.1 ; off-sheet V_DET+
V_DET-: CN5.2 R316.1 ; off-sheet V_DET-
V_REF: CN2.20 R102.1 ; off-sheet V_REF
VB5V: C2.1 C6.1 CN3.8 F1.1
XCLKIN: U33.6(~{OUT}) ; off-sheet XCLKIN
NetC31_2: C31.2 Q4.2(B) R11.2
NetC43_1: C43.1 R316.2 R459.1 U84.6(IN-)
NetC43_2: C43.2 R323.1 R459.2 U84.7(OUT2)
NetC45_2: C45.2 R310.2 R458.2 U84.5(IN+)
NetC93_1: C93.1 R201.2 R202.1
NetC93_2: C93.2 R203.1 R204.1 U87.1(OUT) U87.2(IN-)
NetC94_2: C94.2 R202.2 U87.3(IN+)
NetC95_1: C95.1 R207.2 R208.1
NetC95_2: C95.2 R209.1 R210.1 U87.6(IN-) U87.7(OUT2)
NetC96_1: C96.1 R208.2 U87.5(IN+)
NetC97_1: C97.1 C99.2 D1.2 R31.1 U24.2(VIN1) U24.3(VIN1)
NetC241_2: C241.2 R531.1 U44.2(INPUT) ZD21.2(K)
NetC242_1: C242.1 R465.1 R508.1 U85.6(IN-)
NetC242_2: C242.2 R329.2 R465.2 U85.7(OUT2)
NetC249_1: C249.1 R328.2 R534.1 U85.8(OUT)
NetC249_2: C249.2 R100.2 R534.2 U85.9(IN-)
NetC250_1: C250.1 R363.2 R513.1 U84.9(IN-)
NetC250_2: C250.2 R362.1 R368.1 R513.2 U84.8(OUT)
NetC251_2: C251.2 R364.2 R514.2 U84.10(IN+)
NetC252_2: C252.2 R367.2 R516.2 U84.12(IN+)
NetC253_1: C253.1 R366.2 R515.1 U84.13(IN-)
NetC253_2: C253.2 R365.1 R369.1 R515.2 U84.14(OUT)
NetC266_2: C266.2 R493.2 U33.1(IN) Y1.1
NetC271_2: C271.2 Q60.2(B) R351.2 R352.2
NetC285_2: C285.2 C286.1 R350.2 U59.1(B) U59.2(A)
NetC287_1: C287.1 Q60.3(C) R350.1 R462.1 U44.7
NetC292_2: C292.2 L21.3 R404.1 R857.2 U8.7(B) ZD7.1
NetC294_1: C294.1 R330.2 R460.1 U85.1(OUT)
NetC294_2: C294.2 R460.2 R510.1 U85.2(IN-)
NetC295_1: C295.1 L21.4 R407.2 R857.1 U8.6(A) ZD7.2
NetC297_2: C297.2 R493.1 U33.2(~{OUT}) U33.3(IN) U33.5(IN) Y1.2
NetC298_1: C298.1 D77.1(A) HP2.3 HP70.3 R29.2 R415.1
NetC298_2: C298.2 D77.2(K) HP2.1 HP70.1 R415.2 R854.2
NetC299_1: C299.1 D78.1(A) HP1.3 HP69.3 R418.1 R851.2
NetC299_2: C299.2 D78.2(K) HP1.1 HP69.1 R418.2 R850.2
NetC301_2: C301.2 R540.1 U31.1(IN)
NetC302_1: C302.1 R539.1 U31.5(IN)
NetC305_1: C305.1 C306.1 C313.1 U51.16(VCC) VAR9.2
NetC307_1: C307.1 U51.1(C1+)
NetC307_2: C307.2 U51.3(C1-)
NetC308_2: C308.2 U51.6(V-)
NetC309_1: C309.1 U51.5(C2-)
NetC309_2: C309.2 U51.4(C2+)
NetC318_1: C318.1 DZ85.2 L3.2 U51.14(T1IUT)
NetC319_2: C319.2 DZ86.1 L2.2 U51.13(R1IN)
NetCN1_1: CN1.1 L6.1
NetCN1_5: CN1.5 F2.2
NetCN1_6: CN1.6 F3.1
NetCN3_1: CN3.1 R403.2
NetD13_3: D13.3 R211.2 R212.1 U87.8(OUT)
NetD14_3: D14.3 R205.2 R206.2 U87.14(OUT)
NetD58_3: D58.3 R56.2 U43.2(1Y)
NetD63_3: D63.3 R58.1 U43.10(3Y)
NetD65_3: D65.3 R59.1 U43.11(~{3Z})
NetD66_3: D66.3 R62.1 U43.13(~{4Z})
NetD67_3: D67.3 R60.1 U43.14(4Y)
NetD68_3: D68.3 R55.2 U43.3(~{1Z})
NetF2_1: F2.1 L7.2
NetF3_2: F3.2 L8.2
NetF4_1: F4.1 Q4.3(C)
NetF5_1: F5.1 PH21.4
NetF6_1: F6.1 PH23.4
NetF7_1: F7.1 PH25.4
NetF8_1: F8.1 PH22.4
NetF9_1: F9.1 PH24.4
NetF10_1: F10.1 PH26.4
NetHP1_5: HP1.5 HP69.5 R420.1 U31.13(IN)
NetHP2_5: HP2.5 HP70.5 R421.1 U31.9(IN)
NetJ11_4: J11.4 L13.2 VAR32.2 ZD2.2
NetJ11_5: J11.5 L12.2 VAR34.2 ZD2.1
NetL1_2: L1.2 R403.1 ZD89.1 ZD89.2
NetPH21_1: PH21.1(LED_Anode) R484.1
NetPH22_1: PH22.1(LED_Anode) R483.2
NetPH23_1: PH23.1(LED_Anode) R481.2
NetPH24_1: PH24.1(LED_Anode) R485.2
NetPH25_1: PH25.1(LED_Anode) R482.2
NetPH26_1: PH26.1(LED_Anode) R486.2
NetPH60_2: PH60.2 R164.2 R168.1 R169.1
NetPH61_2: PH61.2 R165.1 R170.1 R171.1
NetPH62_2: PH62.2 R14.1 R83.1 R161.2
NetPH63_2: PH63.2 R15.1 R82.1 R157.2
NetPH64_2: PH64.2 R17.2 R84.1 R158.2
NetPH65_2: PH65.2 R16.2 R85.2 R162.1
NetPH66_2: PH66.2 R18.2 R86.2 R159.2
NetPH67_2: PH67.2 R163.2 R166.2 R167.2
NetPH68_2: PH68.2 R19.2 R80.2 R160.1
NetQ15_2: Q15.2(B) R136.1
NetQ16_2: Q16.2(B) R137.1
NetQ16_3: Q16.3(C) R136.2
NetQ17_1: Q17.1(E) R216.1
NetQ17_2: Q17.2(B) R213.1
NetQ17_3: Q17.3(C) Q18.2(B) Q19.2(B)
NetR3_1: R3.1 R26.2 U5.10(3A)
NetR4_2: R4.2 U31.2(~{OUT})
NetR21_1: R21.1 R69.1 U5.15(4B)
NetR22_1: R22.1 R23.2 U8.1(R)
NetR24_2: R24.2 R68.1 U5.14(4A)
NetR27_2: R27.2 R67.1 U5.9(3B)
NetR31_2: R31.2 U24.4(~{MR}1)
NetR32_2: R32.2 U31.6(~{OUT})
NetR37_1: R37.1 U2.29(VS2)
NetR40_1: R40.1 U2.31(VS0)
NetR43_2: R43.2 U2.23(M1)
NetR44_2: R44.2 R45.2 U2.24(M2)
NetR50_2: R50.2 R110.1 U2.10(IO)
NetR51_2: R51.2 R109.1 U2.9(IO)
NetR52_2: R52.2 R108.1 U2.6(IO_L02N_3)
NetR53_2: R53.2 R107.1 U2.5(IO_L02P_3)
NetR54_1: R54.1 R106.2 U2.4(IO_L01N_3)
NetR61_1: R61.1 U2.25(M0)
NetR66_1: R66.1 U5.13(4Y)
NetR73_1: R73.1 U5.11(3Y)
NetR79_2: R79.2 R402.1 U84.3(IN+)
NetR99_2: R99.2 R533.2 U85.10(IN+)
NetR100_1: R100.1 R101.2 R508.2 U4.7(OUT2)
NetR101_1: R101.1 R102.2 U4.6(IN-)
NetR103_1: R103.1 R105.2 U4.2(IN-)
NetR103_2: R103.2 R510.2 U4.1(OUT)
NetR104_1: R104.1 R362.2 U83.6(IN-)
NetR104_2: R104.2 R325.1 U83.7(OUT2)
NetR141_1: R141.1 U11.12(~{OUT})
NetR142_1: R142.1 U11.10(~{OUT})
NetR143_1: R143.1 U11.8(~{OUT})
NetR144_1: R144.1 U11.6(~{OUT})
NetR145_1: R145.1 U11.4(~{OUT})
NetR146_1: R146.1 U11.2(~{OUT})
NetR147_1: R147.1 U78.4(OUT)
NetR173_1: R173.1 S7.1 U24.15(~{RESET}) U102.1(B) U102.2(A)
NetR184_1: R184.1 U24.5(~{MR}2) U24.16(PG)
NetR203_2: R203.2 R204.2 R205.1 U87.13(IN-)
NetR209_2: R209.2 R210.2 R211.1 U87.9(IN-)
NetR214_1: R214.1 R215.1 U87.10(IN+) U87.12(IN+)
NetR311_2: R311.2 R315.2 U83.12(IN+)
NetR312_2: R312.2 R317.2 U83.5(IN+)
NetR313_2: R313.2 R319.2 U83.3(IN+)
NetR314_2: R314.2 R318.2 U83.10(IN+)
NetR324_1: R324.1 R530.2 U83.14(OUT)
NetR326_1: R326.1 R526.2 U83.1(OUT)
NetR327_1: R327.1 R535.2 U83.8(OUT)
NetR365_2: R365.2 R530.1 U83.13(IN-)
NetR368_2: R368.2 R526.1 U83.2(IN-)
NetR369_2: R369.2 R535.1 U83.9(IN-)
NetR417_2: R417.2 R923.2 U79.1(R)
NetR419_1: R419.1 R924.1 U51.12(R1OUT)
NetR507_1: R507.1 R532.1 U85.3(IN+) U85.5(IN+)
NetR539_2: R539.2 U31.8(~{OUT})
NetR540_2: R540.2 U31.12(~{OUT})
NetU9_1: U9.1(CE#) U116.3(Y)
NetU44_5: U44.5 U44.6

Not connected (* = marked no-connect by the designer): CN1 3*; CN2 29; CN3 9*; DZ85 3*; DZ86 3*; J8 6* 7* 8*; J11 6*; R63 2; U2 21(IP_3) 30(VS1); U4 8(OUT)* 9(IN-)* 10(IN+)* 12(IN+)* 13(IN-)* 14(OUT)*; U5 1(1B)* 2(1A)* 3(1Y)* 5(2Y)* 6(2A)* 7(2B)*; U24 11(NC)* 20(NC)*; U31 4(~{OUT})* 10(~{OUT})*; U43 5(~{2Z})* 6(2Y)* 7(2A)*; U51 7(T2OUT)* 8(R2IN)* 9(R2OUT)* 10(T2IN)*; U78 1(NC)*; U85 12(IN+)* 13(IN-)* 14(OUT)*; ZD87 3*; ZD88 3*

### Notes on the sheet
- 3.3VD用于FPGA以及芯片的电源
- 3.3V用于DSP的电源
- (near U102) 与门
- 1.2V用于FPGA的内核电源
- Labels drawn without touching a wire or pin: /HPULSE, /HSIGN, /OZ, /PULSE, /SIGN, DI3-, DI5-, DI6-, DI7-, DI8-, DO4-, DO5+, DO5-, GND, HPULSE, HSIGN, INPUT, IPM隔离驱动光耦, OB, OCZ, OUTPUT, PULLHI, PULSE, RS485绝对值编码器, SIGN, Z 信号开集极输出, 低速脉冲电路, 外部控制端口, 总线串行数据, 总线串行时钟, 模拟输出监控, 正负反相为了OUTPUT为正, 电脑通讯, 直流电压转换输出, 转矩控制, 过流检测, 速度控制
- (in symbol LM311) +
- (in symbol TLP114A) VCC; A; VO; GND; C

### Library data of the parts
C2 C97 C100 C103 C116 C122 C216-C218 C234 C235 C239 C305 = ELECTRO1: Electrolytic Capacitor
C3-C6 C17 C19-C21 C31-C33 C38-C43 C45-C64 C71 C72 C79 C80 C86 C93-C96 C98 C99 C101 C102 C104 C105 C115 C120 C151 C152 C233 C240-C242 C249-C256 C266 C270 C271 C285-C289 C292 C294 C295 C297-C299 C301-C303 C306-C309 C313-C319 C505-C510 = Cap: Capacitor; Value: 100pF; Published: 8-Jun-2000; LatestRevisionDate: 17-Jul-2002; LatestRevisionNote: Re-released for DXP Platform.; PackageReference: RAD-0.3; Publisher: Altium Limited
CN1 = Header 3X2H: Header, 3-Pin, Dual row, Right Angle; LatestRevisionDate: 17-Jul-2002; LatestRevisionNote: Re-released for DXP Platform.; Publisher: Altium Limited
CN2 = COM46
CN3 = Z2-DB9P/M: Connector; Parts DES: DB9P母头; Parts Number: 00000; Parts Type: 插座; PCB DECAL: DB9; Units: PCS; Parts Model: DB9P母头; Height(mm): *
CN4 = SIP3: jointbar
CN5 = HEADER 15X2
D1 = DIODE
D13 D14 D51 D54-D59 D61-D68 = BAV99
D77 D78 = DIODE SCHOTTKY: Schottky Diode
DZ85 DZ86 = PZM5.6NB2A
F1-F10 = FUSE
HP1 HP2 HP69 HP70 = TLP114A
J8 = Header 5X2: Header, 5-Pin, Dual row; LatestRevisionDate: 17-Jul-2002; LatestRevisionNote: Re-released for DXP Platform.; Publisher: Altium Limited
J11 = Header 6: Header, 6-Pin; LatestRevisionDate: 17-Jul-2002; LatestRevisionNote: Re-released for DXP Platform.; Publisher: Altium Limited
L1-L8 L11-L13 = INDUCTOR2
L21 = GMDG
PH21-PH26 = P127
PH60-PH68 = G2-SO4-TLP181: Opto-coupler; Parts DES: 光耦; Parts Number: 30102; Parts Model: TLP181GB （东芝）; Parts Type: SMD IC; PCB DECAL: SO4 Small Outline; 4 Leads; Body Width 4.4mm; Pitch 2.54mm; Units: PCS; Value: TLP185; Height(mm): 2.5mm
Q4 Q16 Q18 Q19 Q60 = 2N3904: NPN General Purpose Amplifier; Published: 8-Jun-2000; LatestRevisionDate: 15-Jan-2003; LatestRevisionNote: PCB Footprint 'BCY-W3/D4.7' replaced; DatasheetDocument: 1997; PackageDocument: Sep-1998; PackageReference: TO-92A; Publisher: Altium Limited; Code_JEDEC: TO-92A; ComponentLink1Description: Manufacturer Link; ComponentLink1URL: http://www.fairchildsemi.com/; ComponentLink2Description: Datasheet; ComponentLink2URL: http://www.fairchildsemi.com/ds/2N%2F2N3904.pdf
Q15 Q17 = 2N3906: PNP General Purpose Amplifier; Published: 8-Jun-2000; LatestRevisionDate: 15-Jan-2003; LatestRevisionNote: PCB Footprint 'BCY-W3/D4.7' replaced; DatasheetDocument: 1997; PackageDocument: Sep-1998; PackageReference: TO-92A; Publisher: Altium Limited; Code_JEDEC: TO-92A; ComponentLink1Description: Manufacturer Link; ComponentLink1URL: http://www.fairchildsemi.com/; ComponentLink2Description: Datasheet; ComponentLink2URL: http://www.fairchildsemi.com/ds/2N%2F2N3906.pdf
R3-R10 R12-R27 R29-R37 R40 R43-R48 R50-R56 R58-R63 R66-R69 R73 R75 R79 R80 R82-R86 R100-R110 R135 R137 R141-R147 R157-R171 R173 R184 R186 R201-R215 R217 R218 R310-R319 R323-R330 R350 R352 R362-R369 R381 R383 R385 R387-R391 R402 R403 R417 R419-R421 R458-R460 R462 R465 R481-R486 R493 R507-R510 R513-R516 R526 R530-R535 R539 R540 R850-R854 R856-R858 R861 R923 R924 = Res2: Resistor; Value: 1K; Published: 8-Jun-2000; LatestRevisionDate: 17-Jul-2002; LatestRevisionNote: Re-released for DXP Platform.; PackageReference: AXIAL-0.4; Publisher: Altium Limited
R11 R88 R89 R91-R95 R99 R118-R121 R136 R200 R216 R219 R351 R404 R407 R415 R418 = Res2: Resistor; Published: 8-Jun-2000; LatestRevisionDate: 17-Jul-2002; LatestRevisionNote: Re-released for DXP Platform.; PackageReference: AXIAL-0.4; Publisher: Altium Limited; Value: 1K
S7 = SW-PB: Switch; Published: 24-Mar-1999; LatestRevisionDate: 17-Jul-2002; LatestRevisionNote: Re-released for DXP Platform.; PackageReference: SPST-2; Publisher: Altium Limited
U2 = XC3S50A
U4 U83-U85 U87 = LM339AD: Quad Single-Supply Comparator; Published: 17-Jul-2002; LatestRevisionDate: 13-Apr-2006; LatestRevisionNote: IPC-7351 Footprint Added.; DatasheetVersion: 1988; PackageVersion: 1991; PackageReference: 751A-02; Publisher: Altium Limited; PackageDescription: 14-Pin Small Outline Integrated Circuit 1.27 mm Pitch; Code_IPC: SOIC127P600-14; ComponentLink1Description: Manufacturer Link; ComponentLink1URL: http://www.onsemi.com/site/products/taxonomy/0,4438,133,00.html
U5 = AMC26C321
U8 U79 = 65176
U9 = ST25P05VP
U11 U31 U33 = MC74ACT14D: Hex Schmitt-Trigger Inverter; Published: 15-Apr-2002; LatestRevisionDate: 13-Apr-2006; LatestRevisionNote: IPC-7351 Footprint Added.; DatasheetVersion: 9-Apr-1996; PackageReference: 751A-03; Publisher: Altium Limited; PackageDescription: 14-Pin Small Outline Integrated Circuit 1.27 mm Pitch; Code_JEDEC: MS-012-AB; Code_IPC: SOIC127P600-14; ComponentLink1Description: Manufacturer Link; ComponentLink1URL: http://www.onsemi.com/; ComponentLink2Description: Datasheet; ComponentLink2URL: http://www.onsemi.com/pub/Collateral/MC74AC14-D.PDF
U14 = AME8805
U15 = AME8805: pin to pad: 2>3 3>2
U18 = ST95128UP
U24 = TPS70102PW
U26 = LM385
U43 = AM26C31
U44 = LM311
U51 = ADM3202
U116 = MC74HC132AD: Quad 2-Input NAND Gate with Schmitt Trigger Inputs; Published: 17-Jul-2002; LatestRevisionDate: 13-Apr-2006; LatestRevisionNote: IPC-7351 Footprint Added.; DatasheetVersion: 1989; PackageVersion: 1991; PackageReference: 751A-02; Publisher: Altium Limited; PackageDescription: 14-Pin Small Outline Integrated Circuit 1.27 mm Pitch; Code_IPC: SOIC127P600-14; ComponentLink1Description: Manufacturer Link; ComponentLink1URL: http://www.onsemi.com/site/products/parametrics/0,4446,247,00.html; ComponentLink2Description: Ibis Model; ComponentLink2URL: http://www.onsemi.com/pub/Collateral/MC54HC132AJ.IBS
VAR9 VAR31 VAR32 VAR34 = Res Varistor: Varistor (Voltage-Sensitive Resistor); Published: 24-Mar-1999; LatestRevisionDate: 04-Mar-2005; LatestRevisionNote: PCB Footprint replaced.; PackageReference: 6-0805; Publisher: Altium Limited
ZD1 ZD2 ZD7 ZD89 = BAW56
ZD21 = D Zener: Zener Diode; Published: 8-Jun-2000; LatestRevisionDate: 17-Jul-2002; LatestRevisionNote: Re-released for DXP Platform.; PackageReference: DIODE-0.7; Publisher: Altium Limited

## Sheet DSP-Core.SchDoc
size A3
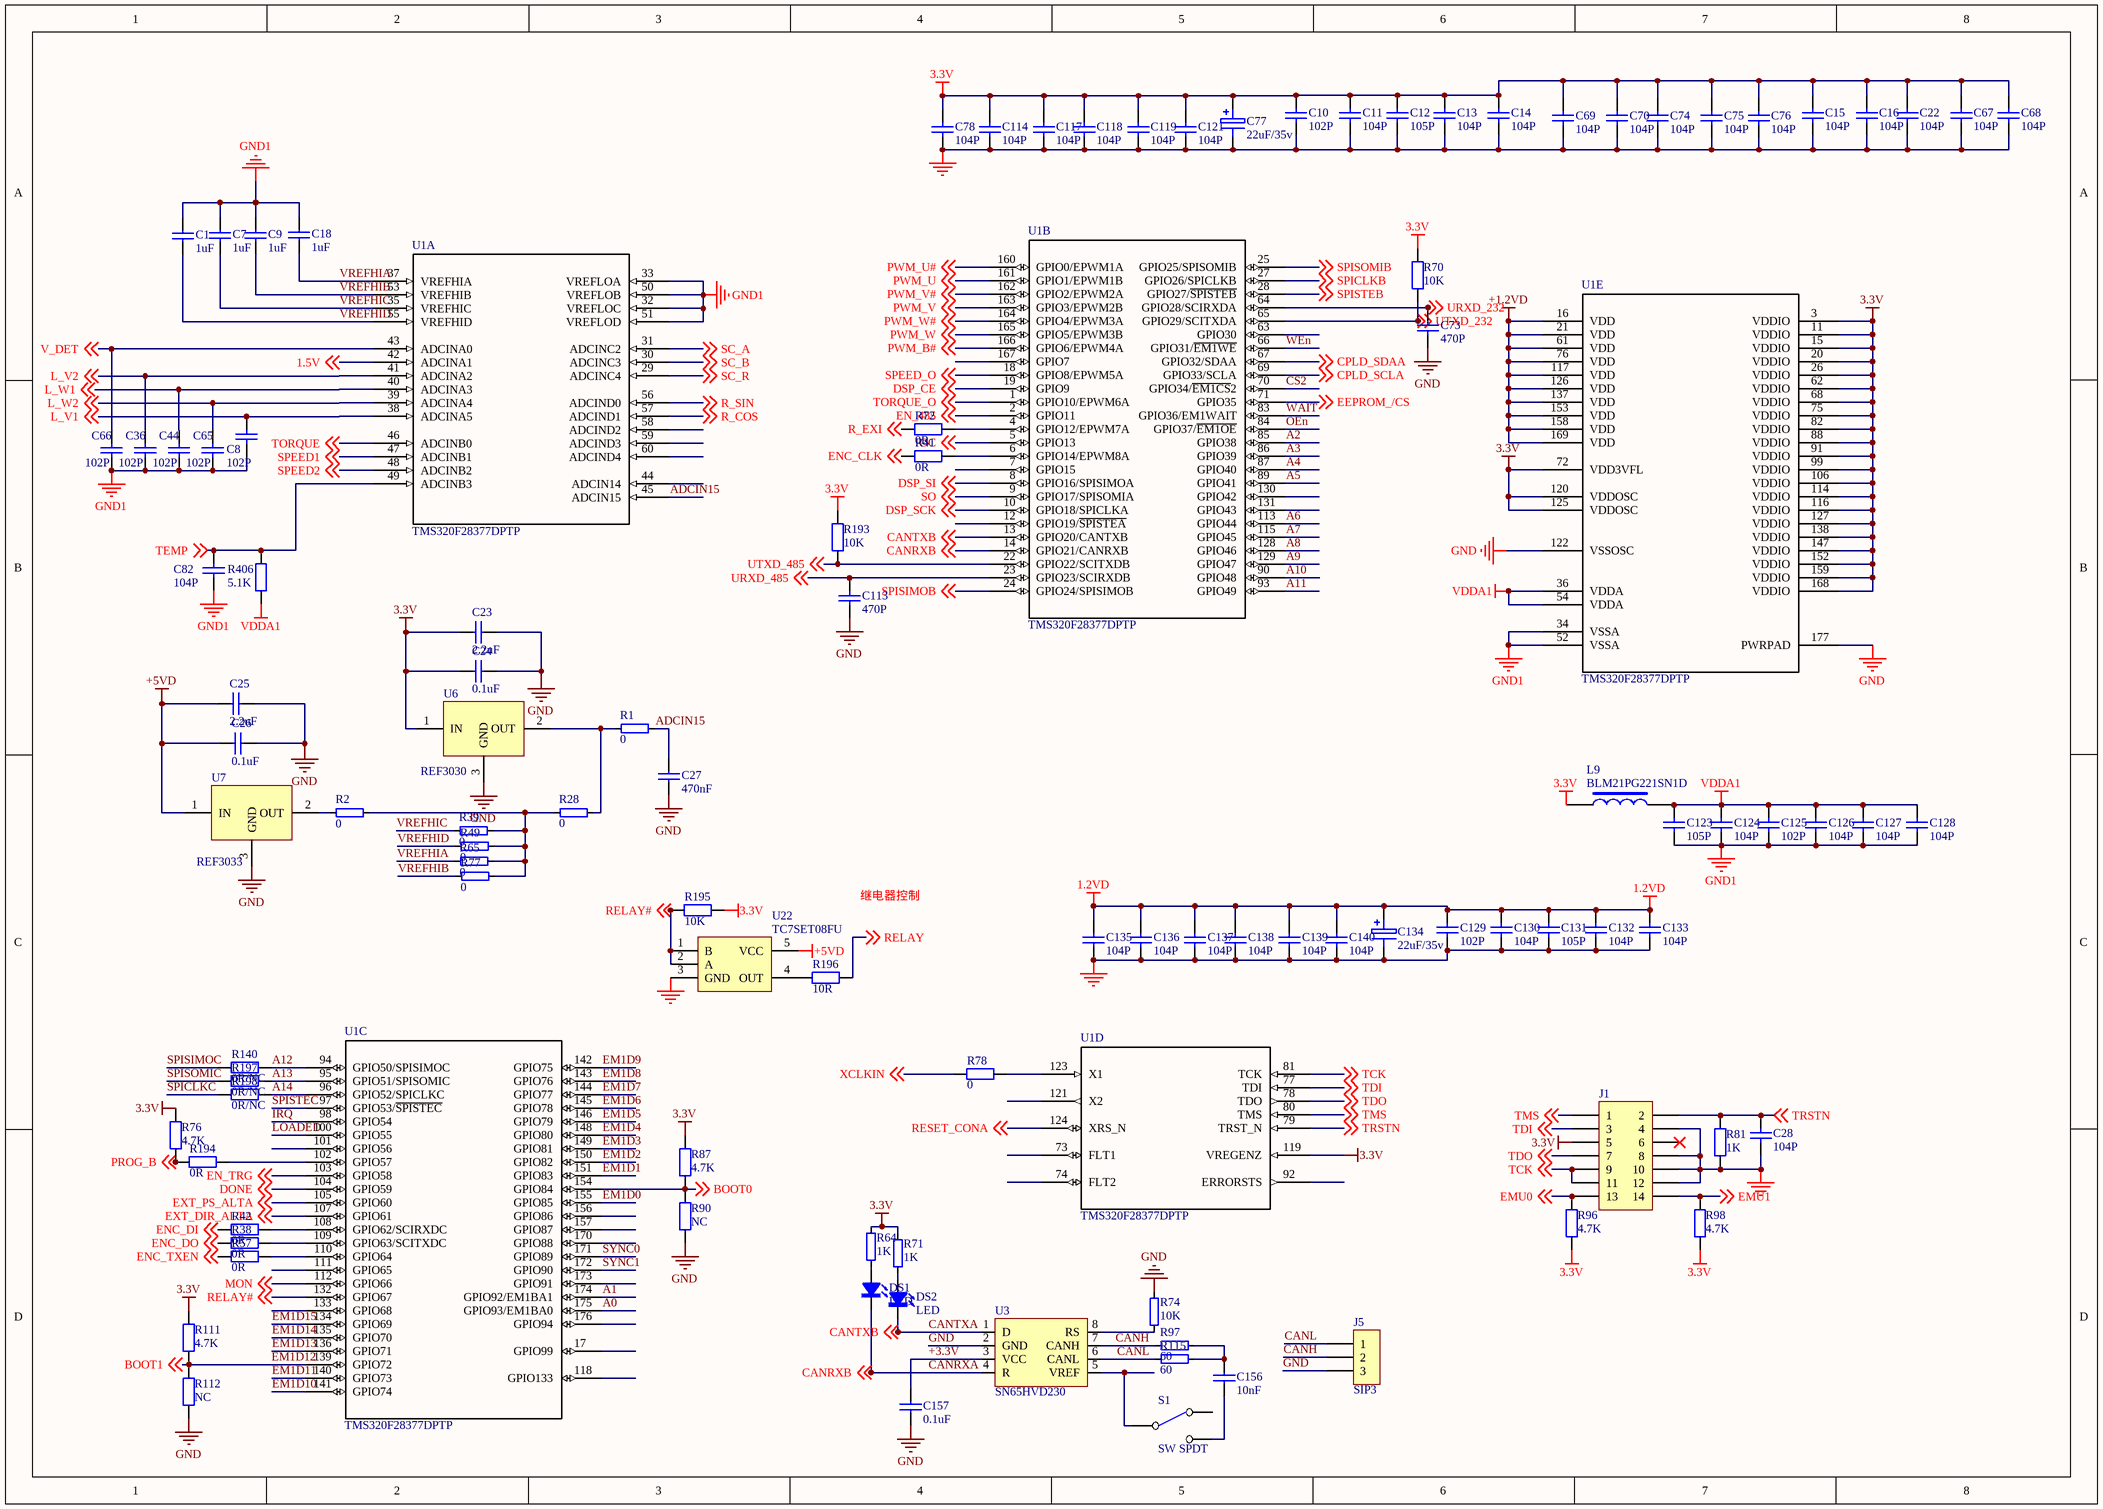
[diagram p4: DSP-Core.SchDoc]

### Parts
C1  1uF  [0805C]
C7  1uF  [0805C]
C8  102P  [0603C]
C9  1uF  [0805C]
C10  102P  [0603C]
C11  104P  [0603C]
C12  105P  [0603C]
C13  104P  [0603C]
C14  104P  [0603C]
C15  104P  [0603C]
C16  104P  [0603C]
C18  1uF  [0805C]
C22  104P  [0603C]
C23  2.2uF  [0603C]
C24  0.1uF  [0603C]
C25  2.2uF  [0603C]
C26  0.1uF  [0603C]
C27  470nF  [0603C]
C28  104P  [0603C]
C36  102P  [0603C]
C44  102P  [0603C]
C65  102P  [0603C]
C66  102P  [0603C]
C67  104P  [0603C]
C68  104P  [0603C]
C69  104P  [0603C]
C70  104P  [0603C]
C73  470P  [0603C]
C74  104P  [0603C]
C75  104P  [0603C]
C76  104P  [0603C]
C77  22uF/35v  [EC46]
C78  104P  [0603C]
C82  104P  [0603C]
C113  470P  [0603C]
C114  104P  [0603C]
C117  104P  [0603C]
C118  104P  [0603C]
C119  104P  [0603C]
C121  104P  [0603C]
C123  105P  [0603C]
C124  104P  [0603C]
C125  102P  [0603C]
C126  104P  [0603C]
C127  104P  [0603C]
C128  104P  [0603C]
C129  102P  [0603C]
C130  104P  [0603C]
C131  105P  [0603C]
C132  104P  [0603C]
C133  104P  [0603C]
C134  22uF/35v  [EC46]
C135  104P  [0603C]
C136  104P  [0603C]
C137  104P  [0603C]
C138  104P  [0603C]
C139  104P  [0603C]
C140  104P  [0603C]
C156  10nF  [0805C]
C157  0.1uF  [0603C]
DS1  LED  [0603D]
DS2  LED  [0603D]
J1  (no value)  [HDR2X7]
J5  SIP3  [SIP3-2.54]
L9  BLM21PG221SN1D  [0805R]
R1  0  [0603R]
R2  0  [0603R]
R28  0  [0603R]
R38  0R  [0603R]
R39  0  [0603R]
R41  0R  [0603R]
R42  0R  [0603R]
R49  0  [0603R]
R57  0R  [0603R]
R64  1K  [0603R]
R65  0  [0603R]
R70  10K  [0603R]
R71  1K  [0603R]
R72  0R  [0603R]
R74  10K  [0603R]
R76  4.7K  [0603R]
R77  0  [0603R]
R78  0  [0603R]
R81  1K  [0603R]
R87  4.7K  [0603R]
R90  NC  [0603R]
R96  4.7K  [0603R]
R97  60  [0603R]
R98  4.7K  [0603R]
R111  4.7K  [0603R]
R112  NC  [0603R]
R115  60  [0603R]
R140  0R/NC  [0603R]
R193  10K  [0603R]
R194  0R  [0603R]
R195  10K  [0603R]
R196  10R  [0603R]
R197  0R/NC  [0603R]
R198  0R/NC  [0603R]
R406  5.1K  [0603R]
S1  SW SPDT  [SIP3-2.54]
U1  TMS320F28377DPTP  [PTP0176F_N]  (parts A,B,C,D,E of 5)
U3  SN65HVD230  [SOIC-8]
U6  REF3030  [SOT-23]
U7  REF3033  [SOT-23]
U22  TC7SET08FU  [SSOP5-P-0.65A]

### Nets
1.2VD: C129.1 C130.1 C131.1 C132.1 C133.1 C134.1 C135.2 C136.2 C137.2 C138.2 C139.2 C140.2
1.5V: U1.42(ADCINA1) ; off-sheet 1.5V
3.3V: C10.1 C11.1 C12.1 C13.1 C14.1 C15.2 C16.2 C22.2 C23.1 C24.1 C67.2 C68.2 C69.2 C70.2 C74.2 C75.2 C76.2 C77.1 C78.2 C114.2 C117.2 C118.2 C119.2 C121.2 J1.5 L9.2 R64.1 R70.2 R71.1 R76.1 R87.1 R96.1 R98.1 R111.1 R193.2 R195.2 U1.3(VDDIO) U1.11(VDDIO) U1.15(VDDIO) U1.20(VDDIO) U1.26(VDDIO) U1.62(VDDIO) U1.68(VDDIO) U1.72(VDD3VFL) U1.75(VDDIO) U1.82(VDDIO) U1.88(VDDIO) U1.91(VDDIO) U1.99(VDDIO) U1.106(VDDIO) U1.114(VDDIO) U1.116(VDDIO) U1.119(VREGENZ) U1.120(VDDOSC) U1.125(VDDOSC) U1.127(VDDIO) U1.138(VDDIO) U1.147(VDDIO) U1.152(VDDIO) U1.159(VDDIO) U1.168(VDDIO) U6.1(IN)
+1.2VD: U1.16(VDD) U1.21(VDD) U1.61(VDD) U1.76(VDD) U1.117(VDD) U1.126(VDD) U1.137(VDD) U1.153(VDD) U1.158(VDD) U1.169(VDD)
+5VD: C25.1 C26.1 U7.1(IN) U22.5(VCC)
GND: C10.2 C11.2 C12.2 C13.2 C14.2 C15.1 C16.1 C22.1 C23.2 C24.2 C25.2 C26.2 C27.1 C28.1 C67.1 C68.1 C69.1 C70.1 C73.2 C74.1 C75.1 C76.1 C77.2 C78.1 C113.2 C114.1 C117.1 C118.1 C119.1 C121.1 C129.2 C130.2 C131.2 C132.2 C133.2 C134.2 C135.1 C136.1 C137.1 C138.1 C139.1 C140.1 C157.2 J1.4 J1.8 J1.10 J1.12 J5.3 R74.2 R81.2 R90.2 R112.2 U1.122(VSSOSC) U1.177(PWRPAD) U3.2(GND) U6.3(GND) U7.3(GND) U22.3(GND)
GND1: C1.1 C7.1 C8.1 C9.1 C18.1 C36.1 C44.1 C65.1 C66.2 C82.2 C123.1 C124.1 C125.1 C126.1 C127.1 C128.1 U1.32(VREFLOC) U1.33(VREFLOA) U1.34(VSSA) U1.50(VREFLOB) U1.51(VREFLOD) U1.52(VSSA)
VDDA1: C123.2 C124.2 C125.2 C126.2 C127.2 C128.2 L9.1 R406.1 U1.36(VDDA) U1.54(VDDA)
+3.3V: C157.1 U3.3(VCC)
A0: U1.175(GPIO93/EM1BA0)
A1: U1.174(GPIO92/EM1BA1)
A2: U1.85(GPIO38)
A3: U1.86(GPIO39)
A4: U1.87(GPIO40)
A5: U1.89(GPIO41)
A6: U1.113(GPIO44)
A7: U1.115(GPIO45)
A8: U1.128(GPIO46)
A9: U1.129(GPIO47)
A10: U1.90(GPIO48)
A11: U1.93(GPIO49)
A12: R140.1 U1.94(GPIO50/SPISIMOC)
A13: R197.1 U1.95(GPIO51/SPISOMIC)
A14: R198.1 U1.96(GPIO52/SPICLKC)
ADCIN15: C27.2 R1.2 U1.45(ADCIN15)
BOOT0: R87.2 R90.1 U1.154(GPIO84) ; off-sheet BOOT0
CANH: J5.2 R97.1 U3.7(CANH)
CANL: J5.1 R115.1 U3.6(CANL)
CANRXA: DS1.2 U1.14(GPIO21/CANRXB) U3.4(R) ; off-sheet CANRXB  [also labelled CANRXB]
CANTXA: DS2.2 U1.13(GPIO20/CANTXB) U3.1(D) ; off-sheet CANTXB  [also labelled CANTXB]
CPLD_SCLA: U1.69(GPIO33/SCLA) ; off-sheet CPLD_SCLA
CPLD_SDAA: U1.67(GPIO32/SDAA) ; off-sheet CPLD_SDAA
CS2: U1.70(GPIO34/~{EM1CS}2)
DONE: U1.104(GPIO59) ; off-sheet DONE
DSP_CE: U1.19(GPIO9) ; off-sheet DSP_CE
DSP_SCK: U1.10(GPIO18/SPICLKA) ; off-sheet DSP_SCK
DSP_SI: U1.8(GPIO16/SPISIMOA) ; off-sheet DSP_SI
EEPROM_/CS: U1.71(GPIO35) ; off-sheet EEPROM_/CS
EM1D0: U1.155(GPIO85)
EM1D1: U1.151(GPIO83)
EM1D2: U1.150(GPIO82)
EM1D3: U1.149(GPIO81)
EM1D4: U1.148(GPIO80)
EM1D5: U1.146(GPIO79)
EM1D6: U1.145(GPIO78)
EM1D7: U1.144(GPIO77)
EM1D8: U1.143(GPIO76)
EM1D9: U1.142(GPIO75)
EM1D10: U1.141(GPIO74)
EM1D11: U1.140(GPIO73)
EM1D12: R111.2 R112.1 U1.139(GPIO72) ; off-sheet BOOT1  [also labelled BOOT1]
EM1D13: U1.136(GPIO71)
EM1D14: U1.135(GPIO70)
EM1D15: U1.134(GPIO69)
EMU0: J1.13 R96.2 ; off-sheet EMU0
EMU1: J1.14 R98.2 ; off-sheet EMU1
EN_485: U1.2(GPIO11) ; off-sheet EN_485
EN_TRG: U1.103(GPIO58) ; off-sheet EN_TRG
ENC_CLK: R41.2 ; off-sheet ENC_CLK
ENC_DI: R38.1 R42.1 ; off-sheet ENC_DO, off-sheet ENC_DI  [also labelled ENC_DO]
ENC_TXEN: R57.1 ; off-sheet ENC_TXEN
EXT_DIR_ALTA: U1.107(GPIO61) ; off-sheet EXT_DIR_ALTA
EXT_PS_ALTA: U1.105(GPIO60) ; off-sheet EXT_PS_ALTA
IRQ: U1.98(GPIO54)
L_V1: C8.2 U1.38(ADCINA5) ; off-sheet L_V1
L_V2: C36.2 U1.41(ADCINA2) ; off-sheet L_V2
L_W1: C44.2 U1.40(ADCINA3) ; off-sheet L_W1
L_W2: C65.2 U1.39(ADCINA4) ; off-sheet L_W2
LOADED: U1.100(GPIO55)
MON: U1.112(GPIO66) ; off-sheet MON
OC: U1.5(GPIO13) ; off-sheet OC
OEn: U1.84(GPIO37/~{EM1OE})
PROG_B: R76.2 R194.2 ; off-sheet PROG_B
PWM_B#: U1.166(GPIO6/EPWM4A) ; off-sheet PWM_B#
PWM_U: U1.161(GPIO1/EPWM1B) ; off-sheet PWM_U
PWM_U#: U1.160(GPIO0/EPWM1A) ; off-sheet PWM_U#
PWM_V: U1.163(GPIO3/EPWM2B) ; off-sheet PWM_V
PWM_V#: U1.162(GPIO2/EPWM2A) ; off-sheet PWM_V#
PWM_W: U1.165(GPIO5/EPWM3B) ; off-sheet PWM_W
PWM_W#: U1.164(GPIO4/EPWM3A) ; off-sheet PWM_W#
R_COS: U1.57(ADCIND1) ; off-sheet R_COS
R_EXI: R72.2 ; off-sheet R_EXI
R_SIN: U1.56(ADCIND0) ; off-sheet R_SIN
RELAY: R196.1 ; off-sheet RELAY
RELAY#: R195.1 U1.132(GPIO67) U22.1(B) U22.2(A) ; off-sheet RELAY#
RESET_CONA: U1.124(XRS_N) ; off-sheet RESET_CONA
SC_A: U1.31(ADCINC2) ; off-sheet SC_A
SC_B: U1.30(ADCINC3) ; off-sheet SC_B
SC_R: U1.29(ADCINC4) ; off-sheet SC_R
SO: U1.9(GPIO17/SPISOMIA) ; off-sheet SO
SPEED1: U1.47(ADCINB1) ; off-sheet SPEED1
SPEED2: U1.48(ADCINB2) ; off-sheet SPEED2
SPEED_O: U1.18(GPIO8/EPWM5A) ; off-sheet SPEED_O
SPICLKB: U1.27(GPIO26/SPICLKB) ; off-sheet SPICLKB
SPICLKC: R198.2
SPISIMOB: U1.24(GPIO24/SPISIMOB) ; off-sheet SPISIMOB
SPISIMOC: R140.2
SPISOMIB: U1.25(GPIO25/SPISOMIB) ; off-sheet SPISOMIB
SPISOMIC: R197.2
SPISTEB: U1.28(GPIO27/~{SPISTEB}) ; off-sheet SPISTEB
SPISTEC: U1.97(GPIO53/~{SPISTEC})
SYNC0: U1.171(GPIO89)
SYNC1: U1.172(GPIO90)
TCK: J1.9 J1.11 U1.81(TCK) ; off-sheet TCK
TDI: J1.3 U1.77(TDI) ; off-sheet TDI
TDO: J1.7 U1.78(TDO) ; off-sheet TDO
TEMP: C82.1 R406.2 U1.49(ADCINB3) ; off-sheet TEMP
TMS: J1.1 U1.80(TMS) ; off-sheet TMS
TORQUE: U1.46(ADCINB0) ; off-sheet TORQUE
TORQUE_O: U1.1(GPIO10/EPWM6A) ; off-sheet TORQUE_O
TRSTN: C28.2 J1.2 R81.1 U1.79(TRST_N) ; off-sheet TRSTN
URXD_232: C73.1 U1.64(GPIO28/SCIRXDA) ; off-sheet URXD_232
URXD_485: C113.1 U1.23(GPIO23/SCIRXDB) ; off-sheet URXD_485
UTXD_232: R70.1 U1.65(GPIO29/SCITXDA) ; off-sheet UTXD_232
UTXD_485: R193.1 U1.22(GPIO22/SCITXDB) ; off-sheet UTXD_485
V_DET: C66.1 U1.43(ADCINA0) ; off-sheet V_DET
VREFHIA: C18.2 R65.1 U1.37(VREFHIA)
VREFHIB: C9.2 R77.1 U1.53(VREFHIB)
VREFHIC: C7.2 R39.1 U1.35(VREFHIC)
VREFHID: C1.2 R49.1 U1.55(VREFHID)
WAIT: U1.83(GPIO36/EM1WAIT)
WEn: U1.66(GPIO31/~{EM1WE})
XCLKIN: R78.1 ; off-sheet XCLKIN
NetC156_1: C156.1 R97.2 R115.2
NetC156_2: C156.2 S1.3
NetDS1_1: DS1.1 R64.2
NetDS2_1: DS2.1 R71.2
NetR1_1: R1.1 R28.2 U6.2(OUT)
NetR2_1: R2.1 U7.2(OUT)
NetR2_2: R2.2 R28.1 R39.2 R49.2 R65.2 R77.2
NetR38_2: R38.2 U1.109(GPIO63/SCITXDC)
NetR41_1: R41.1 U1.6(GPIO14/EPWM8A)
NetR42_2: R42.2 U1.108(GPIO62/SCIRXDC)
NetR57_2: R57.2 U1.110(GPIO64)
NetR72_1: R72.1 U1.4(GPIO12/EPWM7A)
NetR74_1: R74.1 U3.8(RS)
NetR78_2: R78.2 U1.123(X1)
NetR194_1: R194.1 U1.102(GPIO57)
NetR196_2: R196.2 U22.4(OUT)
NetS1_2: S1.2 U3.5(VREF)

Not connected (* = marked no-connect by the designer): J1 6*; S1 1; U1 7(GPIO15) 12(GPIO19/~{SPISTEA}) 17(GPIO99) 44(ADCIN14) 58(ADCIND2) 59(ADCIND3) 60(ADCIND4) 63(GPIO30) 73(FLT1) 74(FLT2) 92(ERRORSTS) 101(GPIO56) 111(GPIO65) 118(GPIO133) 121(X2) 130(GPIO42) 131(GPIO43) 133(GPIO68) 156(GPIO86) 157(GPIO87) 167(GPIO7) 170(GPIO88) 173(GPIO91) 176(GPIO94)

### Notes on the sheet
- 继电器控制

### Library data of the parts
C1 C7 C9 C18 C23-C27 C156 C157 = CAP: SMD-CAP
C8 C10-C16 C22 C28 C36 C44 C65-C70 C73-C76 C78 C82 C113 C114 C117-C119 C121 C123-C133 C135-C140 = Cap: Capacitor; Value: 100pF; Published: 8-Jun-2000; LatestRevisionDate: 17-Jul-2002; LatestRevisionNote: Re-released for DXP Platform.; PackageReference: RAD-0.3; Publisher: Altium Limited
C77 C134 = ELECTRO1: Electrolytic Capacitor
J1 = Header 7X2: Header, 7-Pin, Dual row; LatestRevisionDate: 17-Jul-2002; LatestRevisionNote: Re-released for DXP Platform.; Publisher: Altium Limited
J5 = SIP3: jointbar
L9 = INDUCTOR2
R1 R2 R28 R39 R49 R64 R65 R71 R74 R77 R97 R115 = R-10K: resistor
R38 R41 R42 R57 R70 R72 R76 R78 R87 R90 R96 R98 R111 R112 R140 R193-R198 R406 = Res2: Resistor; Value: 1K; Published: 8-Jun-2000; LatestRevisionDate: 17-Jul-2002; LatestRevisionNote: Re-released for DXP Platform.; PackageReference: AXIAL-0.4; Publisher: Altium Limited
R81 = Res2: Resistor; Published: 8-Jun-2000; LatestRevisionDate: 17-Jul-2002; LatestRevisionNote: Re-released for DXP Platform.; PackageReference: AXIAL-0.4; Publisher: Altium Limited; Value: 1K
U1 = TMS320F28377DPTP: No Description Available; Manufacturer: Texas Instruments; CompType: IC; PIN_COUNT: 177; PartNumber: TMS320F28377DPTP; PackageReference: PTP0176F; MountType: SMT; RoHS: Y; RefDes: RefDes; Type: DEV; Value: Value; Copyright: Copyright (C) 2018 Accelerated Designs. All rights reserved
U3 = SN65HV230
U7 = REF3030

## Sheet EnDat-Biss.SchDoc
size A4
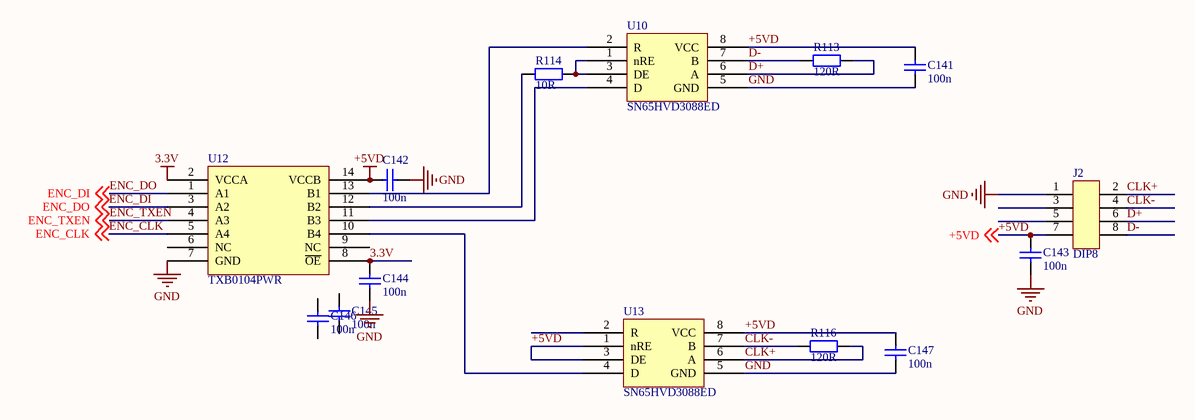
[diagram p5: EnDat-Biss.SchDoc]

### Parts
C141  100n  [0603C]
C142  100n  [0603C]
C143  100n  [0603C]
C144  100n  [0603C]
C145  100n  [0603C]
C146  100n  [0603C]
C147  100n  [0603C]
J2  DIP8  [DIP8-2.54]
R113  120R  [0603R]
R114  10R  [0603R]
R116  120R  [0603R]
U10  SN65HVD3088ED  [SOIC-8]
U12  TXB0104PWR  [TSSOP-14]
U13  SN65HVD3088ED  [SOIC-8]

### Nets
3.3V: C144.1 U12.2(VCCA) U12.8(~{OE})
+5VD: C141.2 C142.2 C143.1 C147.2 J2.7 U10.8(VCC) U12.14(VCCB) U13.1(nRE) U13.3(DE) U13.8(VCC) ; off-sheet +5VD
GND: C141.1 C142.1 C143.2 C144.2 C147.1 J2.1 U10.5(GND) U12.7(GND) U13.5(GND)
CLK+: J2.2 R116.1 U13.6(A)
CLK-: J2.4 R116.2 U13.7(B)
D+: J2.6 R113.1 U10.6(A)
D-: J2.8 R113.2 U10.7(B)
ENC_CLK: U12.5(A4) ; off-sheet ENC_CLK
ENC_DI: U12.1(A1) U12.3(A2) ; off-sheet ENC_DO, off-sheet ENC_DI  [also labelled ENC_DO]
ENC_TXEN: U12.4(A3) ; off-sheet ENC_TXEN
NetR114_1: R114.1 U10.1(nRE) U10.3(DE)
NetR114_2: R114.2 U12.12(B2)
NetU10_2: U10.2(R) U12.13(B1)
NetU10_4: U10.4(D) U12.11(B3)
NetU12_10: U12.10(B4) U13.4(D)

Not connected (* = marked no-connect by the designer): C145 1 2; C146 1 2; J2 3 5; U12 6(NC) 9(NC); U13 2(R)

### Library data of the parts
C141-C147 = Cap: Capacitor; Value: 100pF; Published: 8-Jun-2000; LatestRevisionDate: 17-Jul-2002; LatestRevisionNote: Re-released for DXP Platform.; PackageReference: RAD-0.3; Publisher: Altium Limited
J2 = DIP8: Connectors; Set Position: 0.5; Published: 8-Jun-2000; LatestRevisionDate: 17-Jul-2002; LatestRevisionNote: Re-released for DXP Platform.; PackageReference: AXIAL-0.6; Publisher: Altium Limited
R113 R114 R116 = Res2: Resistor; Value: 1K; Published: 8-Jun-2000; LatestRevisionDate: 17-Jul-2002; LatestRevisionNote: Re-released for DXP Platform.; PackageReference: AXIAL-0.4; Publisher: Altium Limited
U10 U13 = SN65HVD3088
U12 = TXB0104

## Sheet SinCos.SchDoc
size A4
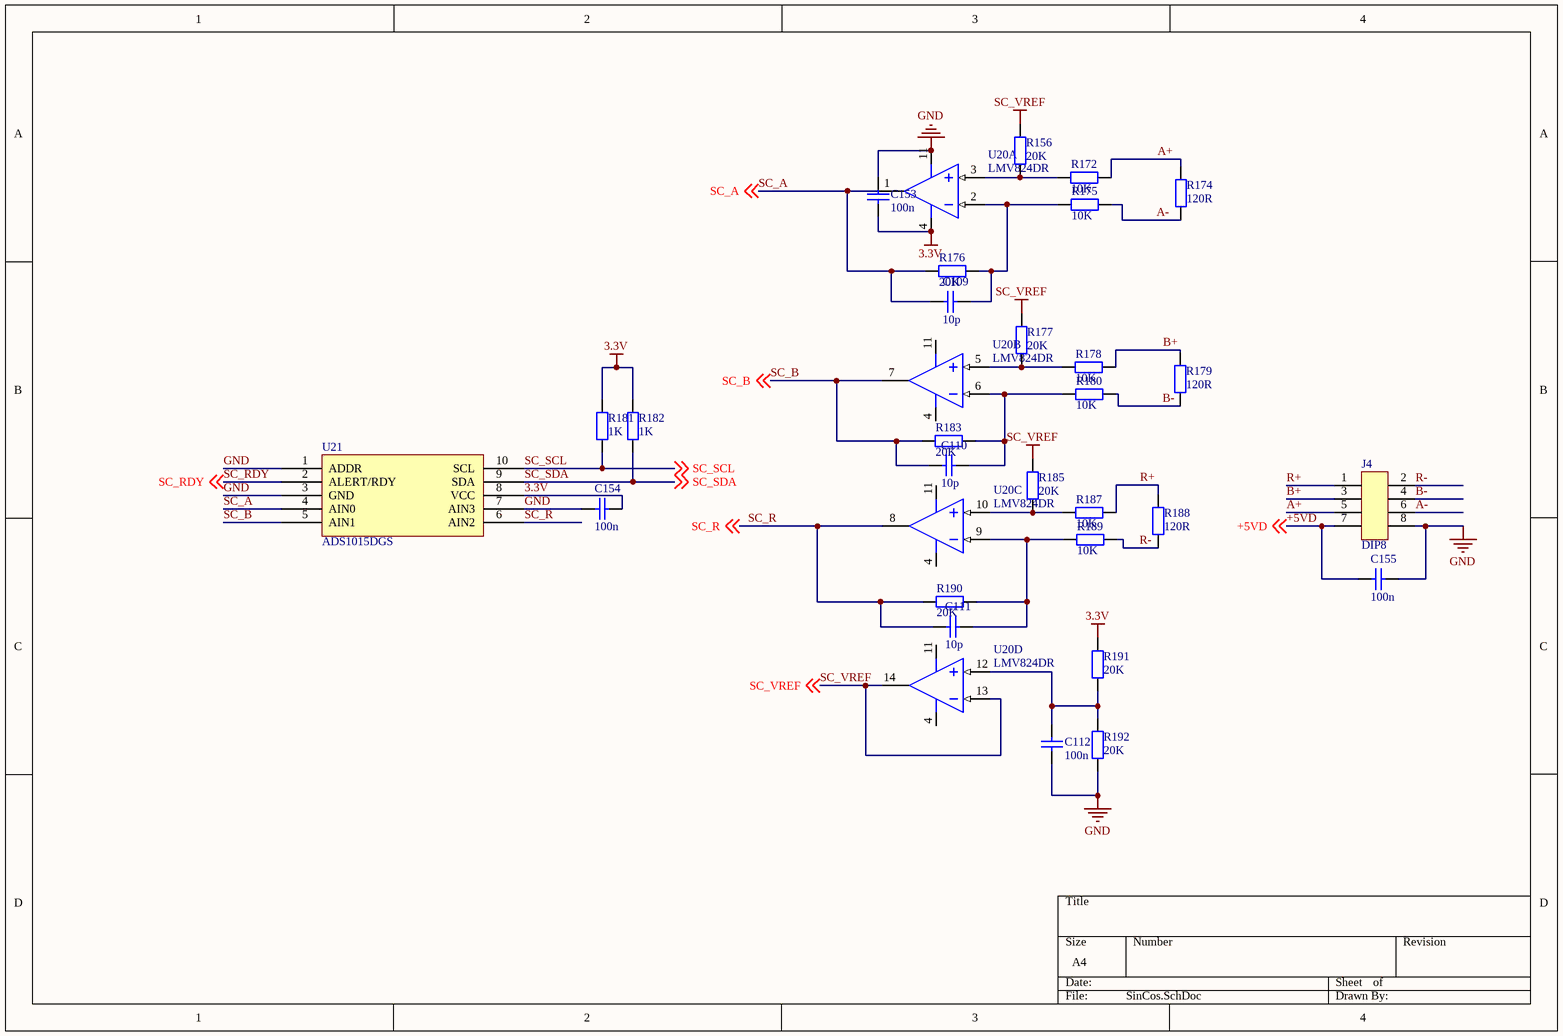
[diagram p6: SinCos.SchDoc]

### Parts
C109  10p  [0603C]
C110  10p  [0603C]
C111  10p  [0603C]
C112  100n  [0603C]
C153  100n  [0603C]
C154  100n  [0603C]
C155  100n  [0603C]
J4  DIP8  [DIP8-2.54]
R156  20K  [0603R]
R172  10K  [0603R]
R174  120R  [0603R]
R175  10K  [0603R]
R176  20K  [0603R]
R177  20K  [0603R]
R178  10K  [0603R]
R179  120R  [0603R]
R180  10K  [0603R]
R181  1K  [0603R]
R182  1K  [0603R]
R183  20K  [0603R]
R185  20K  [0603R]
R187  10K  [0603R]
R188  120R  [0603R]
R189  10K  [0603R]
R190  20K  [0603R]
R191  20K  [0603R]
R192  20K  [0603R]
U20  LMV824DR  [SOP-14]  (parts A,B,C,D of 4)
U21  ADS1015DGS  [VSSOP-10]

### Nets
3.3V: C153.1 C154.1 R181.1 R182.1 R191.1 U20.4(GND) U21.8(VCC)
+5VD: C155.2 J4.7 ; off-sheet +5VD
GND: C112.1 C153.2 C154.2 C155.1 J4.8 R192.2 U20.11(V+) U21.1(ADDR) U21.3(GND) U21.7(AIN3)
SC_VREF: R156.1 R177.1 R185.1 U20.13(IN-) U20.14(OUT) ; off-sheet SC_VREF
A+: J4.5 R172.1 R174.1
A-: J4.6 R174.2 R175.1
B+: J4.3 R178.1 R179.1
B-: J4.4 R179.2 R180.1
R+: J4.1 R187.1 R188.1
R-: J4.2 R188.2 R189.1
SC_A: C109.1 R176.1 U20.1(OUT) U21.4(AIN0) ; off-sheet SC_A
SC_B: C110.1 R183.1 U20.7(OUT2) U21.5(AIN1) ; off-sheet SC_B
SC_R: C111.1 R190.1 U20.8(OUT) U21.6(AIN2) ; off-sheet SC_R
SC_RDY: U21.2(ALERT/RDY) ; off-sheet SC_RDY
SC_SCL: R181.2 U21.10(SCL) ; off-sheet SC_SCL
SC_SDA: R182.2 U21.9(SDA) ; off-sheet SC_SDA
NetC109_2: C109.2 R175.2 R176.2 U20.2(IN-)
NetC110_2: C110.2 R180.2 R183.2 U20.6(IN-)
NetC111_2: C111.2 R189.2 R190.2 U20.9(IN-)
NetC112_2: C112.2 R191.2 R192.1 U20.12(IN+)
NetR156_2: R156.2 R172.2 U20.3(IN+)
NetR177_2: R177.2 R178.2 U20.5(IN+)
NetR185_2: R185.2 R187.2 U20.10(IN+)

### Library data of the parts
C109-C112 C153-C155 = Cap: Capacitor; Value: 100pF; Published: 8-Jun-2000; LatestRevisionDate: 17-Jul-2002; LatestRevisionNote: Re-released for DXP Platform.; PackageReference: RAD-0.3; Publisher: Altium Limited
J4 = DIP8: Connectors; Set Position: 0.5; Published: 8-Jun-2000; LatestRevisionDate: 17-Jul-2002; LatestRevisionNote: Re-released for DXP Platform.; PackageReference: AXIAL-0.6; Publisher: Altium Limited
R156 R172 R174-R180 R183 R185 R187-R192 = Res2: Resistor; Value: 1K; Published: 8-Jun-2000; LatestRevisionDate: 17-Jul-2002; LatestRevisionNote: Re-released for DXP Platform.; PackageReference: AXIAL-0.4; Publisher: Altium Limited
R181 R182 = Res2: Resistor; Published: 8-Jun-2000; LatestRevisionDate: 17-Jul-2002; LatestRevisionNote: Re-released for DXP Platform.; PackageReference: AXIAL-0.4; Publisher: Altium Limited; Value: 1K
U20 = LM339AD: Quad Single-Supply Comparator; Published: 17-Jul-2002; LatestRevisionDate: 13-Apr-2006; LatestRevisionNote: IPC-7351 Footprint Added.; DatasheetVersion: 1988; PackageVersion: 1991; PackageReference: 751A-02; Publisher: Altium Limited; PackageDescription: 14-Pin Small Outline Integrated Circuit 1.27 mm Pitch; Code_IPC: SOIC127P600-14; ComponentLink1Description: Manufacturer Link; ComponentLink1URL: http://www.onsemi.com/site/products/taxonomy/0,4438,133,00.html
U21 = ADS1015